# Altium project PCIC.PrjPCB
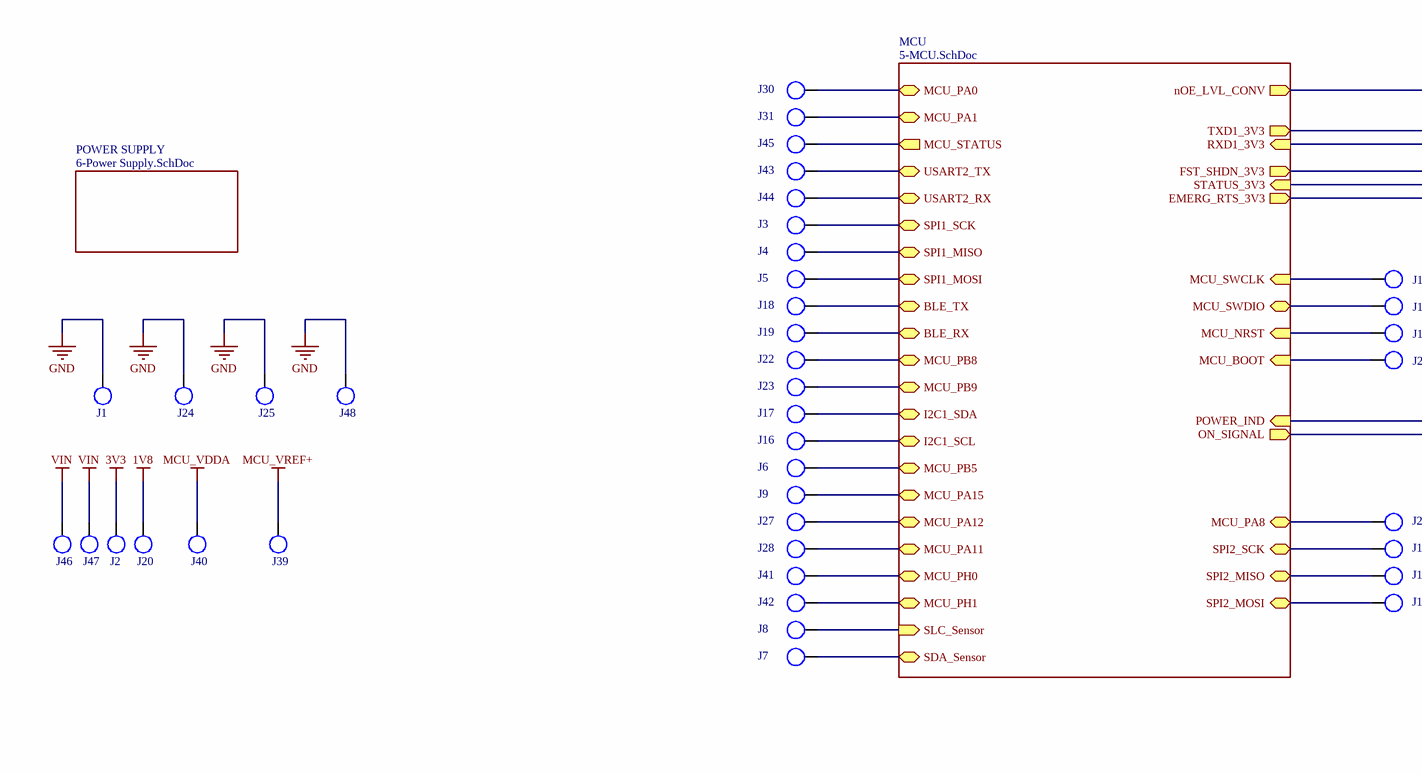
[diagram p0: 1-Main.SchDoc, left]
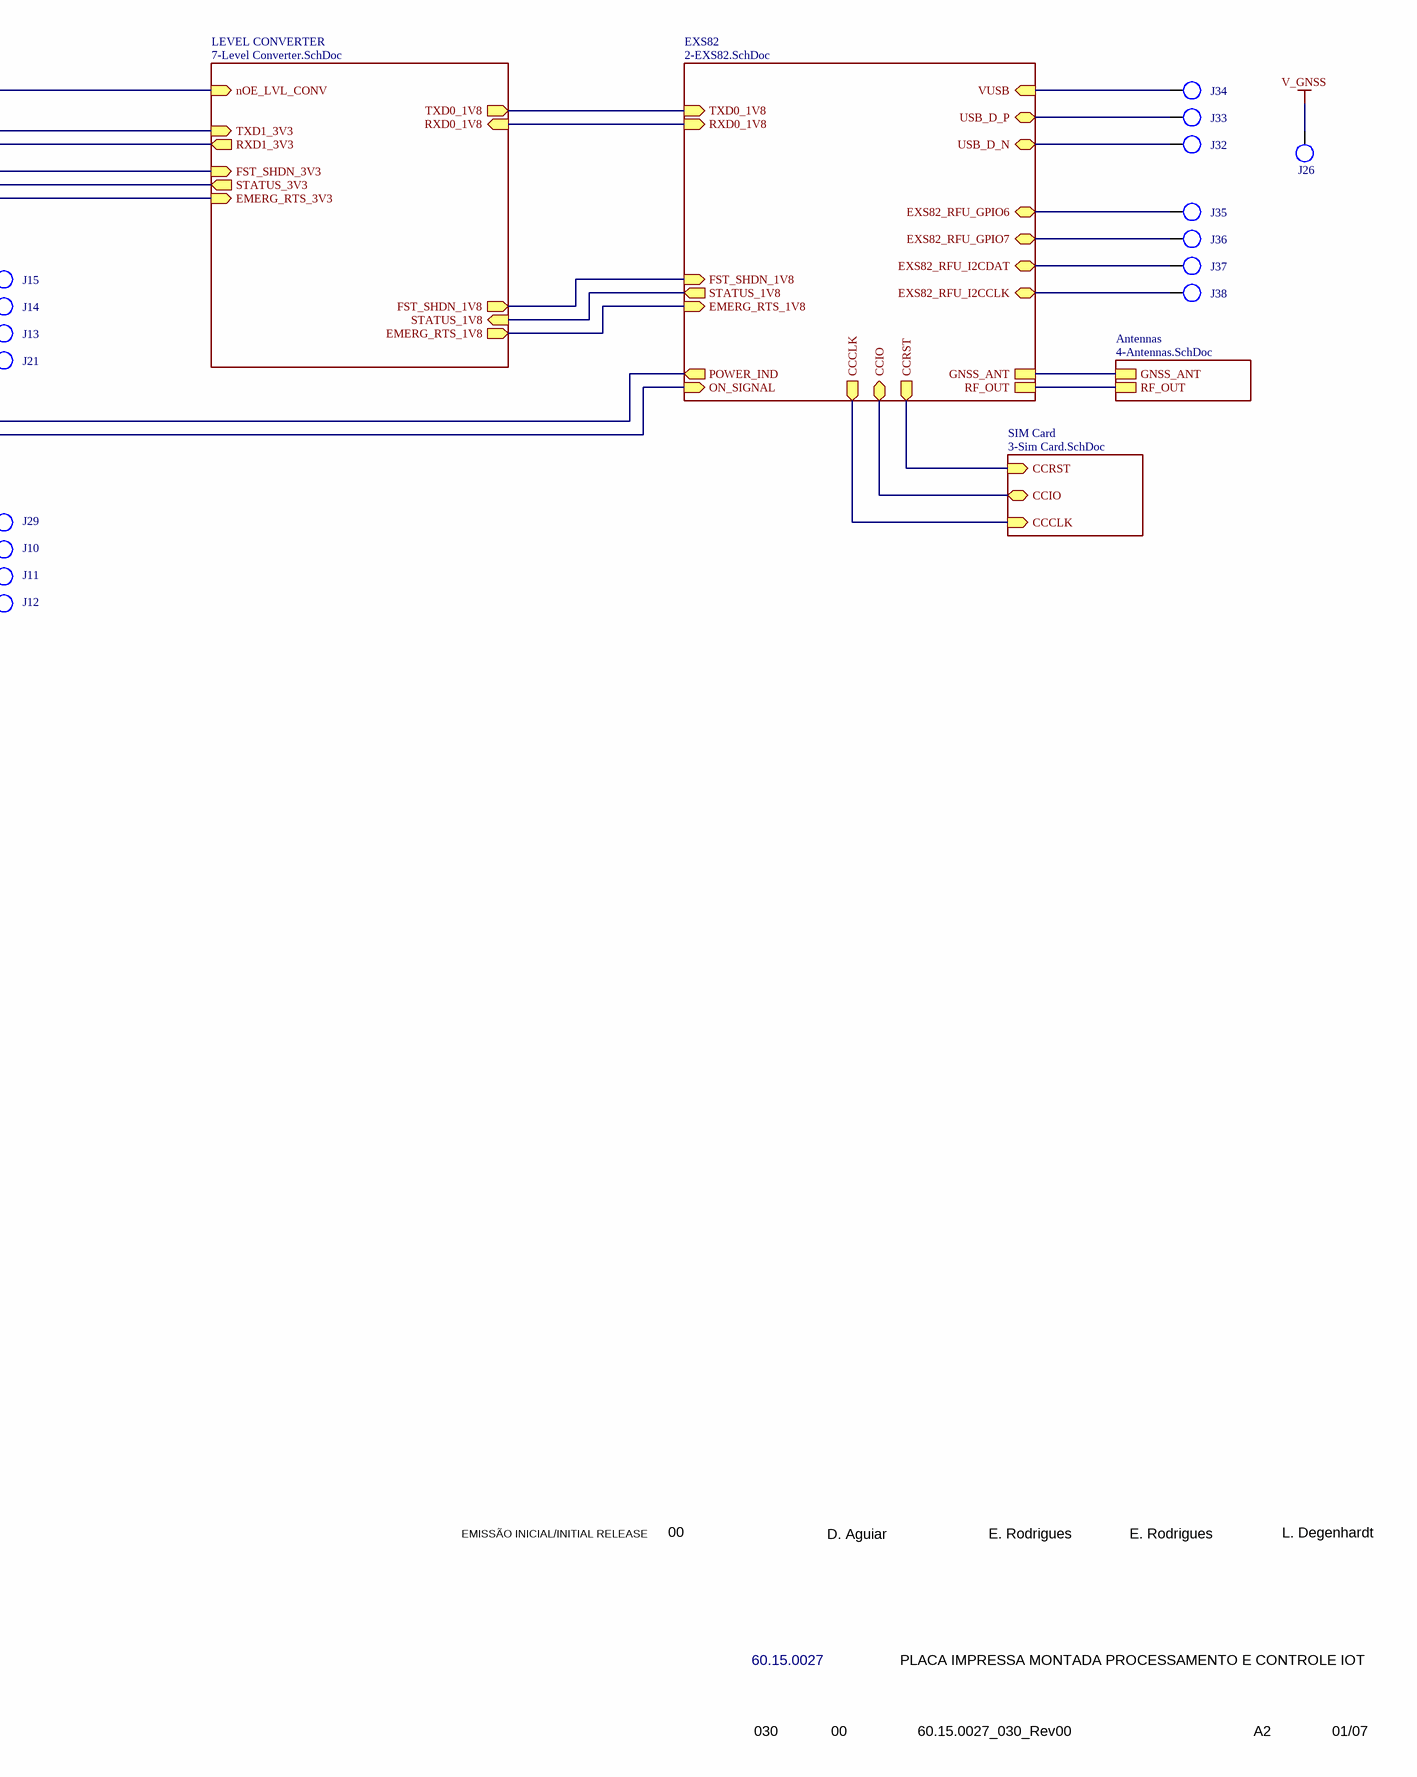
[diagram p1: 1-Main.SchDoc, right]
7 sheets, 168 parts. Net scope: hierarchical (ports join the sheet entries above them; power ports are global).
Board file: 58.13.0093_400_Rev00.PcbDoc
Sheets:
  1-Main.SchDoc
    MCU = 5-MCU.SchDoc
    LEVEL CONVERTER = 7-Level Converter.SchDoc
    EXS82 = 2-EXS82.SchDoc
    POWER SUPPLY = 6-Power Supply.SchDoc
    Antennas = 4-Antennas.SchDoc
    SIM Card = 3-Sim Card.SchDoc

## Sheet 1-Main.SchDoc
size 594 x 420 mm; SheetNumber: 1; SheetTotal: 7; Organization: Altium Limited; Address1: L3, 12a Rodborough Rd; Address2: Frenchs Forest; Address3: NSW; Address4: Australia 2086; PageSetup: Record=PageOptions|CenterHorizontal=True|CenterVertical=True|PrintScale=0.98|XCorrection=1.00|YCorrection=1.00|PrintKind=0|BorderSize=5000000|LeftOffset=0|BottomOffset=0|Orientation=2|PaperLength=1000|PaperWidth=1000|Scale=100|PaperSource=7|PrintQuality=-3|MediaType=1|DitherType=10|PrintScaleMode=1|PaperKind=A3|PaperIndex=8; NumTotalFolhas: 7; NumFolha: 1

### Parts
J1  CASTELATION  [CASTELATION]  (value not drawn)
J2  CASTELATION  [CASTELATION]  (value not drawn)
J3  CASTELATION  [CASTELATION]  (value not drawn)
J4  CASTELATION  [CASTELATION]  (value not drawn)
J5  CASTELATION  [CASTELATION]  (value not drawn)
J6  CASTELATION  [CASTELATION]  (value not drawn)
J7  CASTELATION  [CASTELATION]  (value not drawn)
J8  CASTELATION  [CASTELATION]  (value not drawn)
J9  CASTELATION  [CASTELATION]  (value not drawn)
J10  CASTELATION  [CASTELATION]  (value not drawn)
J11  CASTELATION  [CASTELATION]  (value not drawn)
J12  CASTELATION  [CASTELATION]  (value not drawn)
J13  CASTELATION  [CASTELATION]  (value not drawn)
J14  CASTELATION  [CASTELATION]  (value not drawn)
J15  CASTELATION  [CASTELATION]  (value not drawn)
J16  CASTELATION  [CASTELATION]  (value not drawn)
J17  CASTELATION  [CASTELATION]  (value not drawn)
J18  CASTELATION  [CASTELATION]  (value not drawn)
J19  CASTELATION  [CASTELATION]  (value not drawn)
J20  CASTELATION  [CASTELATION]  (value not drawn)
J21  CASTELATION  [CASTELATION]  (value not drawn)
J22  CASTELATION  [CASTELATION]  (value not drawn)
J23  CASTELATION  [CASTELATION]  (value not drawn)
J24  CASTELATION  [CASTELATION]  (value not drawn)
J25  CASTELATION  [CASTELATION]  (value not drawn)
J26  CASTELATION  [CASTELATION]  (value not drawn)
J27  CASTELATION  [CASTELATION]  (value not drawn)
J28  CASTELATION  [CASTELATION]  (value not drawn)
J29  CASTELATION  [CASTELATION]  (value not drawn)
J30  CASTELATION  [CASTELATION]  (value not drawn)
J31  CASTELATION  [CASTELATION]  (value not drawn)
J32  CASTELATION  [CASTELATION]  (value not drawn)
J33  CASTELATION  [CASTELATION]  (value not drawn)
J34  CASTELATION  [CASTELATION]  (value not drawn)
J35  CASTELATION  [CASTELATION]  (value not drawn)
J36  CASTELATION  [CASTELATION]  (value not drawn)
J37  CASTELATION  [CASTELATION]  (value not drawn)
J38  CASTELATION  [CASTELATION]  (value not drawn)
J39  CASTELATION  [CASTELATION]  (value not drawn)
J40  CASTELATION  [CASTELATION]  (value not drawn)
J41  CASTELATION  [CASTELATION]  (value not drawn)
J42  CASTELATION  [CASTELATION]  (value not drawn)
J43  CASTELATION  [CASTELATION]  (value not drawn)
J44  CASTELATION  [CASTELATION]  (value not drawn)
J45  CASTELATION  [CASTELATION]  (value not drawn)
J46  CASTELATION  [CASTELATION]  (value not drawn)
J47  CASTELATION  [CASTELATION]  (value not drawn)
J48  CASTELATION  [CASTELATION]  (value not drawn)

### Sub-sheets
Antennas = 4-Antennas.SchDoc: RF_OUT, GNSS_ANT
EXS82 = 2-EXS82.SchDoc: EMERG_RTS_1V8 (in), RXD0_1V8 (in), VUSB (in), USB_D_P (bidir), TXD0_1V8 (in), USB_D_N (bidir), POWER_IND (out), ON_SIGNAL (in), EXS82_RFU_GPIO6 (bidir), EXS82_RFU_GPIO7 (bidir), EXS82_RFU_I2CDAT (bidir), EXS82_RFU_I2CCLK (bidir), FST_SHDN_1V8 (in), STATUS_1V8 (out), GNSS_ANT, RF_OUT, CCRST (out), CCIO (bidir), CCCLK (out)
LEVEL CONVERTER = 7-Level Converter.SchDoc: RXD1_3V3 (out), RXD0_1V8 (in), TXD0_1V8 (out), EMERG_RTS_1V8 (out), TXD1_3V3 (in), EMERG_RTS_3V3 (in), STATUS_1V8 (in), STATUS_3V3 (out), FST_SHDN_3V3 (in), FST_SHDN_1V8 (out), nOE_LVL_CONV (in)
MCU = 5-MCU.SchDoc: RXD1_3V3 (in), TXD1_3V3 (out), EMERG_RTS_3V3 (out), MCU_PH1 (bidir), MCU_PA11 (bidir), MCU_PA12 (bidir), POWER_IND (in), MCU_PB5 (bidir), MCU_PH0 (bidir), ON_SIGNAL (out), I2C1_SDA (bidir), BLE_TX (bidir), MCU_PA15 (bidir), SPI1_MOSI (bidir), MCU_PB8 (bidir), MCU_SWCLK (in), I2C1_SCL (bidir), MCU_SWDIO (bidir), SPI1_MISO (bidir), SPI1_SCK (bidir), MCU_PB9 (bidir), USART2_RX (bidir), BLE_RX (bidir), USART2_TX (bidir), MCU_STATUS (out), MCU_PA0 (bidir), MCU_PA1 (bidir), MCU_NRST (in), STATUS_3V3 (in), FST_SHDN_3V3 (out), nOE_LVL_CONV (out), MCU_BOOT (in), MCU_PA8 (bidir), SPI2_MOSI (bidir), SPI2_MISO (bidir), SPI2_SCK (bidir), SLC_Sensor (in), SDA_Sensor (bidir)
POWER SUPPLY = 6-Power Supply.SchDoc: no entries
SIM Card = 3-Sim Card.SchDoc: CCRST (in), CCCLK (in), CCIO (bidir)

### Nets
1V8: J20.1
3V3: J2.1
GND: J1.1 J24.1 J25.1 J48.1
MCU_VDDA: J40.1
MCU_VREF+: J39.1
V_GNSS: J26.1
VIN: J46.1 J47.1
BLE_RX: J19.1 ; sheet MCU/BLE_RX
BLE_TX: J18.1 ; sheet MCU/BLE_TX
CCCLK: sheet EXS82/CCCLK, sheet SIM Card/CCCLK
CCIO: sheet EXS82/CCIO, sheet SIM Card/CCIO
CCRST: sheet EXS82/CCRST, sheet SIM Card/CCRST
EMERG_RTS_1V8: sheet LEVEL CONVERTER/EMERG_RTS_1V8, sheet EXS82/EMERG_RTS_1V8
EMERG_RTS_3V3: sheet MCU/EMERG_RTS_3V3, sheet LEVEL CONVERTER/EMERG_RTS_3V3
EXS82_RFU_GPIO6: J35.1 ; sheet EXS82/EXS82_RFU_GPIO6
EXS82_RFU_GPIO7: J36.1 ; sheet EXS82/EXS82_RFU_GPIO7
EXS82_RFU_I2CCLK: J38.1 ; sheet EXS82/EXS82_RFU_I2CCLK
EXS82_RFU_I2CDAT: J37.1 ; sheet EXS82/EXS82_RFU_I2CDAT
FST_SHDN_1V8: sheet LEVEL CONVERTER/FST_SHDN_1V8, sheet EXS82/FST_SHDN_1V8
FST_SHDN_3V3: sheet MCU/FST_SHDN_3V3, sheet LEVEL CONVERTER/FST_SHDN_3V3
GNSS_ANT: sheet EXS82/GNSS_ANT, sheet Antennas/GNSS_ANT
I2C1_SCL: J16.1 ; sheet MCU/I2C1_SCL
I2C1_SDA: J17.1 ; sheet MCU/I2C1_SDA
MCU_BOOT: J21.1 ; sheet MCU/MCU_BOOT
MCU_NRST: J13.1 ; sheet MCU/MCU_NRST
MCU_PA0: J30.1 ; sheet MCU/MCU_PA0
MCU_PA1: J31.1 ; sheet MCU/MCU_PA1
MCU_PA8: J29.1 ; sheet MCU/MCU_PA8
MCU_PA11: J28.1 ; sheet MCU/MCU_PA11
MCU_PA12: J27.1 ; sheet MCU/MCU_PA12
MCU_PA15: J9.1 ; sheet MCU/MCU_PA15
MCU_PB5: J6.1 ; sheet MCU/MCU_PB5
MCU_PB8: J22.1 ; sheet MCU/MCU_PB8
MCU_PB9: J23.1 ; sheet MCU/MCU_PB9
MCU_PH0: J41.1 ; sheet MCU/MCU_PH0
MCU_PH1: J42.1 ; sheet MCU/MCU_PH1
MCU_STATUS: J45.1 ; sheet MCU/MCU_STATUS
MCU_SWCLK: J15.1 ; sheet MCU/MCU_SWCLK
MCU_SWDIO: J14.1 ; sheet MCU/MCU_SWDIO
nOE_LVL_CONV: sheet MCU/nOE_LVL_CONV, sheet LEVEL CONVERTER/nOE_LVL_CONV
ON_SIGNAL: sheet MCU/ON_SIGNAL, sheet EXS82/ON_SIGNAL
POWER_IND: sheet MCU/POWER_IND, sheet EXS82/POWER_IND
RF_OUT: sheet EXS82/RF_OUT, sheet Antennas/RF_OUT
RXD0_1V8: sheet LEVEL CONVERTER/RXD0_1V8, sheet EXS82/RXD0_1V8
RXD1_3V3: sheet MCU/RXD1_3V3, sheet LEVEL CONVERTER/RXD1_3V3
SDA_Sensor: J7.1 ; sheet MCU/SDA_Sensor
SLC_Sensor: J8.1 ; sheet MCU/SLC_Sensor
SPI1_MISO: J4.1 ; sheet MCU/SPI1_MISO
SPI1_MOSI: J5.1 ; sheet MCU/SPI1_MOSI
SPI1_SCK: J3.1 ; sheet MCU/SPI1_SCK
SPI2_MISO: J11.1 ; sheet MCU/SPI2_MISO
SPI2_MOSI: J12.1 ; sheet MCU/SPI2_MOSI
SPI2_SCK: J10.1 ; sheet MCU/SPI2_SCK
STATUS_1V8: sheet LEVEL CONVERTER/STATUS_1V8, sheet EXS82/STATUS_1V8
STATUS_3V3: sheet MCU/STATUS_3V3, sheet LEVEL CONVERTER/STATUS_3V3
TXD0_1V8: sheet LEVEL CONVERTER/TXD0_1V8, sheet EXS82/TXD0_1V8
TXD1_3V3: sheet MCU/TXD1_3V3, sheet LEVEL CONVERTER/TXD1_3V3
USART2_RX: J44.1 ; sheet MCU/USART2_RX
USART2_TX: J43.1 ; sheet MCU/USART2_TX
USB_D_N: J32.1 ; sheet EXS82/USB_D_N
USB_D_P: J33.1 ; sheet EXS82/USB_D_P
VUSB: J34.1 ; sheet EXS82/VUSB

### Notes on the sheet
- EMISSÃO INICIAL/INITIAL RELEASE
- 00
- D. Aguiar
- E. Rodrigues
- L. Degenhardt
- 60.15.0027
- PLACA IMPRESSA MONTADA PROCESSAMENTO E CONTROLE IOT
- 030
- 60.15.0027_030_Rev00
- A2
- 01/07
- 1
- 2
- 3
- 4
- 5
- 6
- 7
- 8
- A
- B
- C
- D
- E
- F
- G
- H
- HISTORICO DA REV / EVOLUTION
- REV
- DATA / DATE
- DOCUMENTO DE ENGENHARIA DE PRODUTO
- ELABORADO / DRAWN
- DOCUMENT OF PRODUCT ENGINEERING
- VERIFICADO / CHECKED
- APROVADO / APPROVED
- QUALIDADE / QUALITY
- CÓDIGO / CODE
- DESCRIÇÃO / DESCRIPTION
- DOC
- ARQUIVO / FILE
- FORM./SIZE
- FOLHA / PAGE

## Sheet 5-MCU.SchDoc
size 594 x 420 mm; SheetNumber: 5; SheetTotal: 7; PageSetup: Record=PageOptions|CenterHorizontal=False|CenterVertical=False|PrintScale=0.43|XCorrection=0.00|YCorrection=0.00|PrintKind=1|BorderSize=5000000|LeftOffset=0|BottomOffset=0|Orientation=2|PaperLength=5940|PaperWidth=4200|Scale=100|PaperSource=7|PrintQuality=-4|MediaType=1|DitherType=10|PaperKind=Personal. 1: 215,9 x 279,4 mm|PrintScaleMode=0; NumTotalFolhas: 7; NumFolha: 5
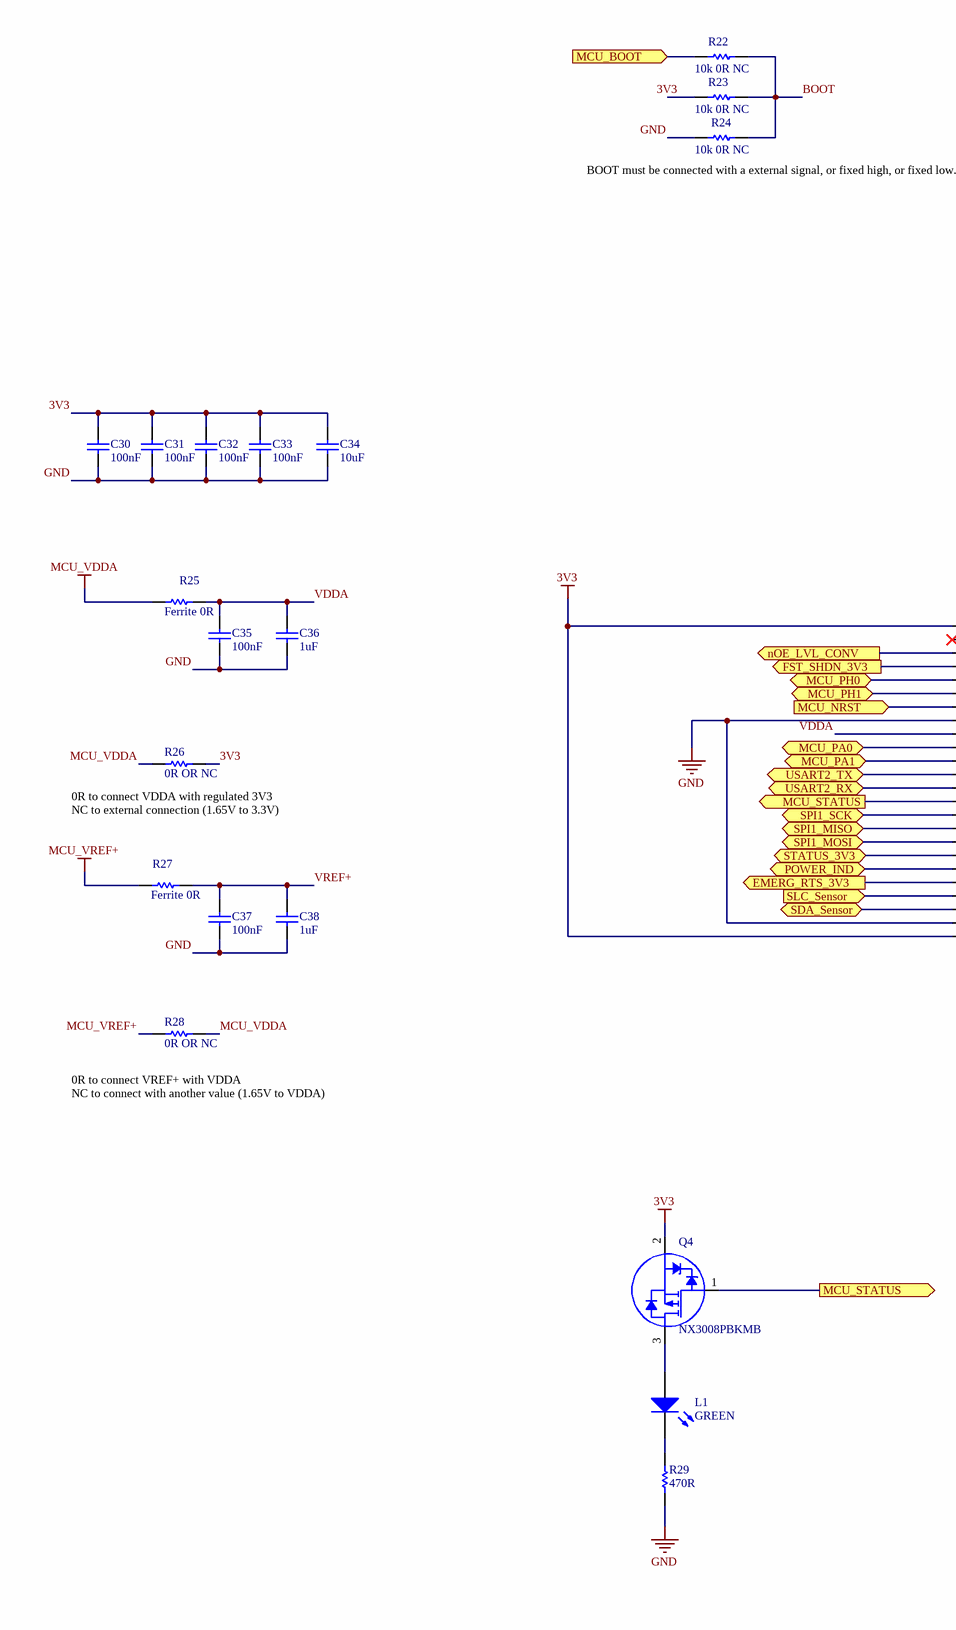
[diagram p2: 5-MCU.SchDoc, left]
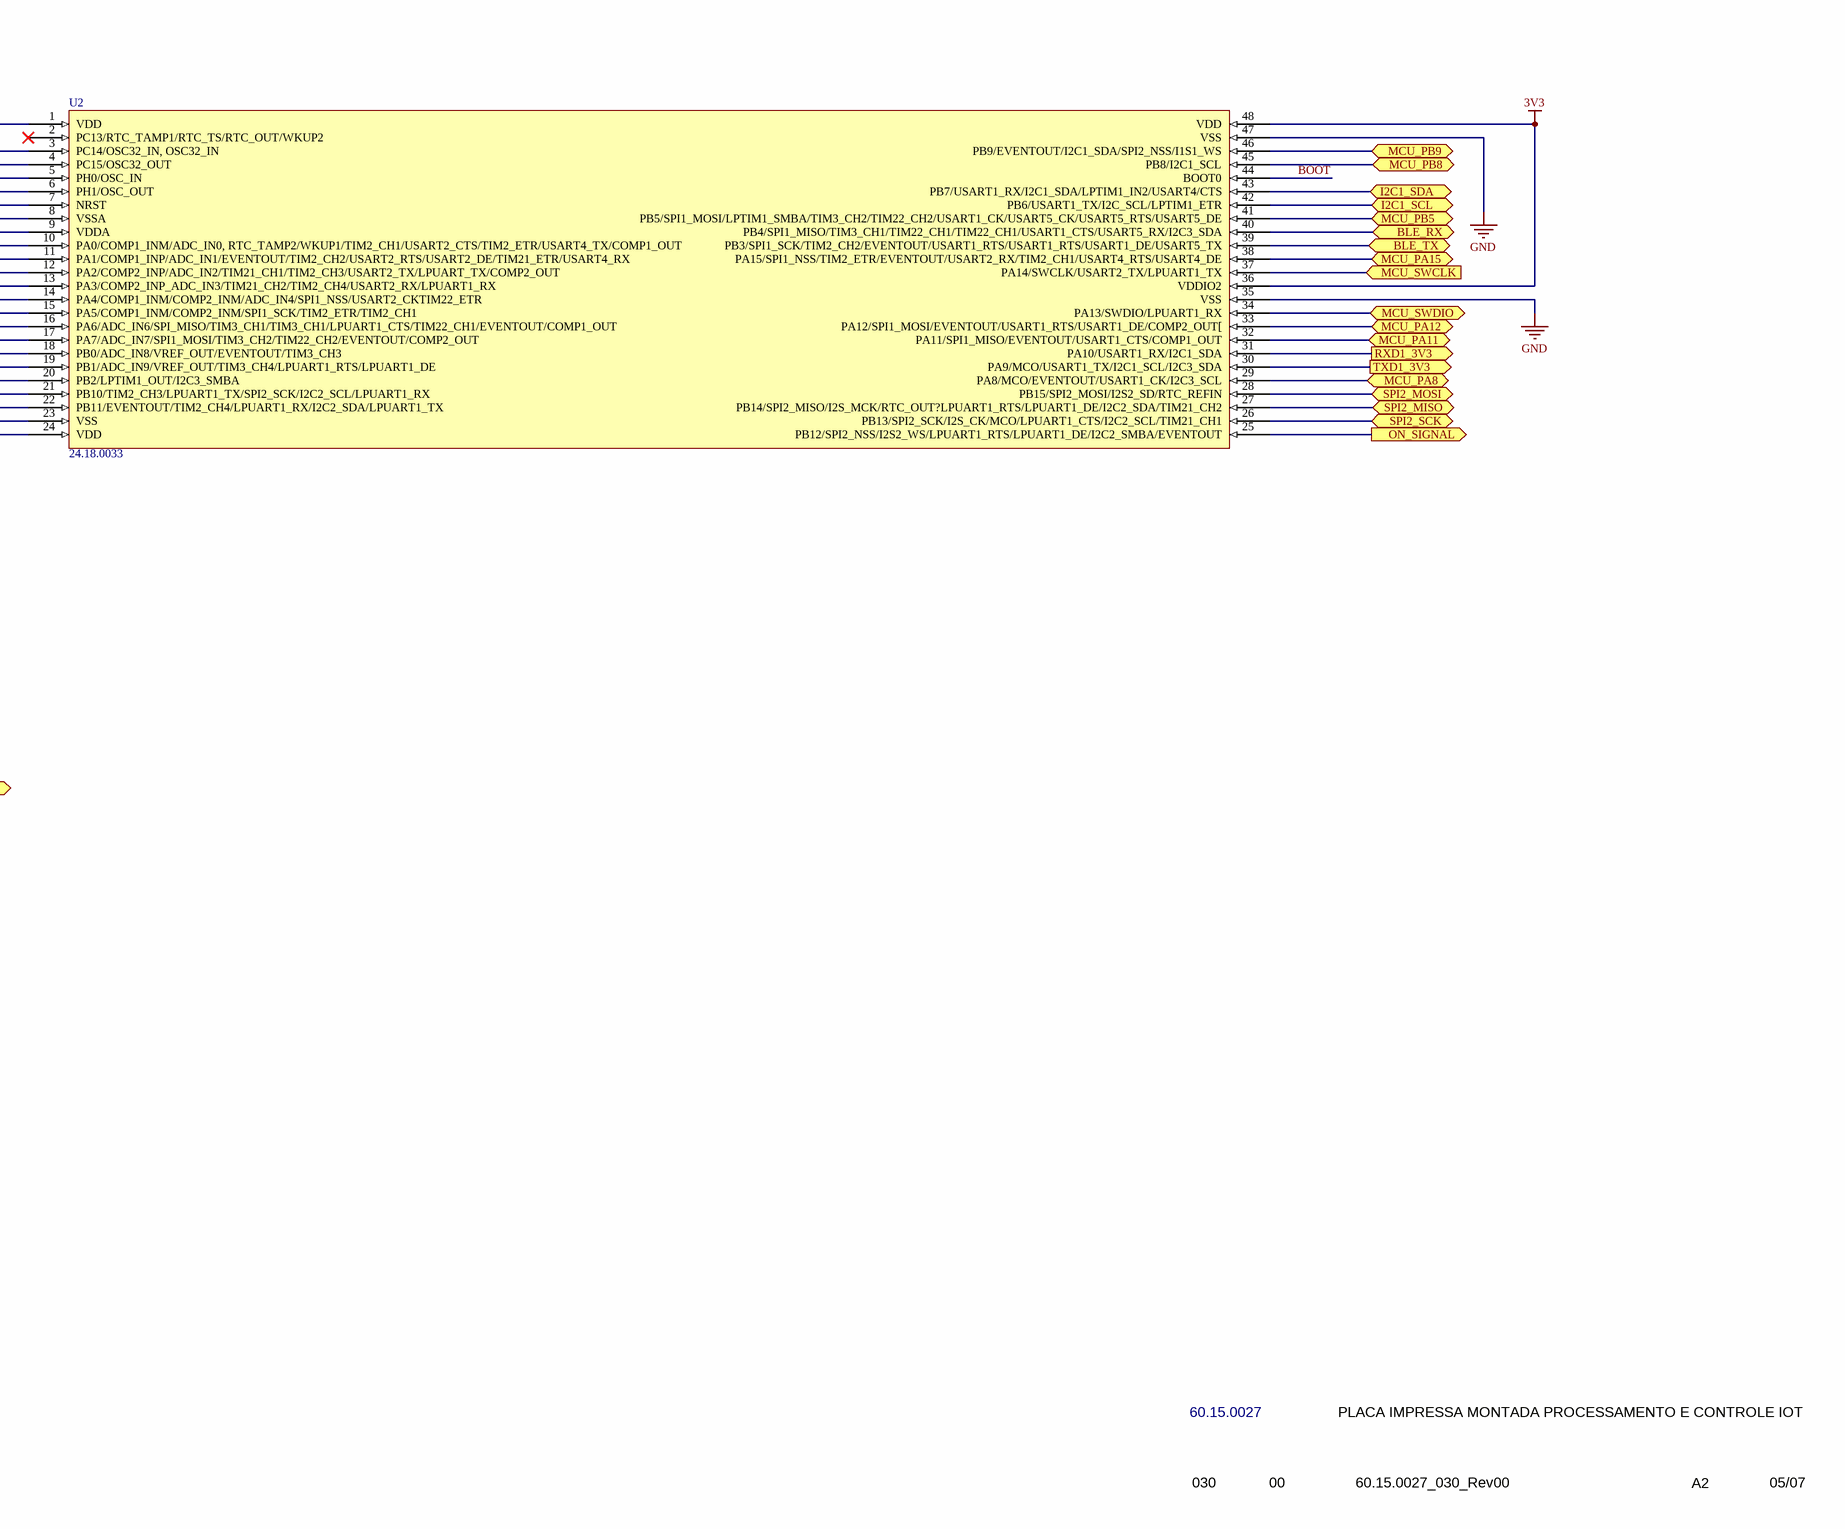
[diagram p3: 5-MCU.SchDoc, right]

### Parts
C30  16.23.0803  [16.23.0803]  (value not drawn)
C31  16.23.0803  [16.23.0803]  (value not drawn)
C32  16.23.0803  [16.23.0803]  (value not drawn)
C33  16.23.0803  [16.23.0803]  (value not drawn)
C34  value 10uF  [16.23.0805]  (hidden comment: 16.23.0805)
C35  16.23.0803  [16.23.0803]  (value not drawn)
C36  value 1uF  [16.23.0806]  (hidden comment: 16.23.0806)
C37  16.23.0803  [16.23.0803]  (value not drawn)
C38  value 1uF  [16.23.0806]  (hidden comment: 16.23.0806)
L1  32.17.0036  [32.17.0036]  (value not drawn)
Q4  72.19.0071  [72.19.0071]  (value not drawn)
R22  value 10k 0R NC  [66.21.1646]  (hidden comment: 66.21.1646)
R23  value 10k 0R NC  [66.21.1646]  (hidden comment: 66.21.1646)
R24  value 10k 0R NC  [66.21.1646]  (hidden comment: 66.21.1646)
R25  value Ferrite 0R  [66.24.1337]  (hidden comment: 66.24.1337)
R26  value 0R OR NC  [66.24.1337]  (hidden comment: 66.24.1337)
R27  value Ferrite 0R  [66.24.1337]  (hidden comment: 66.24.1337)
R28  value 0R OR NC  [66.24.1337]  (hidden comment: 66.24.1337)
R29  value 470R  [66.33.4700]  (hidden comment: 66.33.4700)
U2  24.18.0033  [24.18.0033]

### Ports
BLE_RX (bidir), BLE_TX (bidir), EMERG_RTS_3V3 (out), FST_SHDN_3V3 (out), I2C1_SCL (bidir), I2C1_SDA (bidir), MCU_BOOT (in), MCU_NRST (in), MCU_PA0 (bidir), MCU_PA1 (bidir), MCU_PA8 (bidir), MCU_PA11 (bidir), MCU_PA12 (bidir), MCU_PA15 (bidir), MCU_PB5 (bidir), MCU_PB8 (bidir), MCU_PB9 (bidir), MCU_PH0 (bidir), MCU_PH1 (bidir), MCU_STATUS (out), MCU_SWCLK (in), MCU_SWDIO (bidir), nOE_LVL_CONV (out), ON_SIGNAL (out), POWER_IND (bidir), RXD1_3V3 (out), SDA_Sensor (bidir), SLC_Sensor (in), SPI1_MISO (bidir), SPI1_MOSI (bidir), SPI1_SCK (bidir), SPI2_MISO (bidir), SPI2_MOSI (bidir), SPI2_SCK (bidir), STATUS_3V3 (bidir), TXD1_3V3 (out), USART2_RX (bidir), USART2_TX (bidir)

### Nets
3V3: C30.2 C31.2 C32.2 C33.2 C34.2 Q4.2(S) R23.1 R26.2 U2.1(VDD) U2.24(VDD) U2.36(VDDIO2) U2.48(VDD)
GND: C30.1 C31.1 C32.1 C33.1 C34.1 C35.1 C36.1 C37.1 C38.1 R24.1 R29.1 U2.8(VSSA) U2.23(VSS) U2.35(VSS) U2.47(VSS)
MCU_VDDA: R25.1 R26.1 R28.2
MCU_VREF+: R27.1 R28.1
BLE_RX: U2.40(PB4/SPI1_MISO/TIM3_CH1/TIM22_CH1/TIM22_CH1/USART1_CTS/USART5_RX/I2C3_SDA) ; port BLE_RX
BLE_TX: U2.39(PB3/SPI1_SCK/TIM2_CH2/EVENTOUT/USART1_RTS/USART1_RTS/USART1_DE/USART5_TX) ; port BLE_TX
BOOT: R22.2 R23.2 R24.2 U2.44(BOOT0)
EMERG_RTS_3V3: U2.20(PB2/LPTIM1_OUT/I2C3_SMBA) ; port EMERG_RTS_3V3
FST_SHDN_3V3: U2.4(PC15/OSC32_OUT) ; port FST_SHDN_3V3
I2C1_SCL: U2.42(PB6/USART1_TX/I2C_SCL/LPTIM1_ETR) ; port I2C1_SCL
I2C1_SDA: U2.43(PB7/USART1_RX/I2C1_SDA/LPTIM1_IN2/USART4/CTS) ; port I2C1_SDA
MCU_BOOT: R22.1 ; port MCU_BOOT
MCU_NRST: U2.7(NRST) ; port MCU_NRST
MCU_PA0: U2.10(PA0/COMP1_INM/ADC_IN0,_RTC_TAMP2/WKUP1/TIM2_CH1/USART2_CTS/TIM2_ETR/USART4_TX/COMP1_OUT) ; port MCU_PA0
MCU_PA1: U2.11(PA1/COMP1_INP/ADC_IN1/EVENTOUT/TIM2_CH2/USART2_RTS/USART2_DE/TIM21_ETR/USART4_RX) ; port MCU_PA1
MCU_PA8: U2.29(PA8/MCO/EVENTOUT/USART1_CK/I2C3_SCL) ; port MCU_PA8
MCU_PA11: U2.32(PA11/SPI1_MISO/EVENTOUT/USART1_CTS/COMP1_OUT) ; port MCU_PA11
MCU_PA12: U2.33(PA12/SPI1_MOSI/EVENTOUT/USART1_RTS/USART1_DE/COMP2_OUT[) ; port MCU_PA12
MCU_PA15: U2.38(PA15/SPI1_NSS/TIM2_ETR/EVENTOUT/USART2_RX/TIM2_CH1/USART4_RTS/USART4_DE) ; port MCU_PA15
MCU_PB5: U2.41(PB5/SPI1_MOSI/LPTIM1_SMBA/TIM3_CH2/TIM22_CH2/USART1_CK/USART5_CK/USART5_RTS/USART5_DE) ; port MCU_PB5
MCU_PB8: U2.45(PB8/I2C1_SCL) ; port MCU_PB8
MCU_PB9: U2.46(PB9/EVENTOUT/I2C1_SDA/SPI2_NSS/I1S1_WS) ; port MCU_PB9
MCU_PH0: U2.5(PH0/OSC_IN) ; port MCU_PH0
MCU_PH1: U2.6(PH1/OSC_OUT) ; port MCU_PH1
MCU_STATUS: Q4.1(G) U2.14(PA4/COMP1_INM/COMP2_INM/ADC_IN4/SPI1_NSS/USART2_CKTIM22_ETR) ; port MCU_STATUS
MCU_SWCLK: U2.37(PA14/SWCLK/USART2_TX/LPUART1_TX) ; port MCU_SWCLK
MCU_SWDIO: U2.34(PA13/SWDIO/LPUART1_RX) ; port MCU_SWDIO
nOE_LVL_CONV: U2.3(PC14/OSC32_IN,_OSC32_IN) ; port nOE_LVL_CONV
ON_SIGNAL: U2.25(PB12/SPI2_NSS/I2S2_WS/LPUART1_RTS/LPUART1_DE/I2C2_SMBA/EVENTOUT) ; port ON_SIGNAL
POWER_IND: U2.19(PB1/ADC_IN9/VREF_OUT/TIM3_CH4/LPUART1_RTS/LPUART1_DE) ; port POWER_IND
RXD1_3V3: U2.31(PA10/USART1_RX/I2C1_SDA) ; port RXD1_3V3
SDA_Sensor: U2.22(PB11/EVENTOUT/TIM2_CH4/LPUART1_RX/I2C2_SDA/LPUART1_TX) ; port SDA_Sensor
SLC_Sensor: U2.21(PB10/TIM2_CH3/LPUART1_TX/SPI2_SCK/I2C2_SCL/LPUART1_RX) ; port SLC_Sensor
SPI1_MISO: U2.16(PA6/ADC_IN6/SPI_MISO/TIM3_CH1/TIM3_CH1/LPUART1_CTS/TIM22_CH1/EVENTOUT/COMP1_OUT) ; port SPI1_MISO
SPI1_MOSI: U2.17(PA7/ADC_IN7/SPI1_MOSI/TIM3_CH2/TIM22_CH2/EVENTOUT/COMP2_OUT) ; port SPI1_MOSI
SPI1_SCK: U2.15(PA5/COMP1_INM/COMP2_INM/SPI1_SCK/TIM2_ETR/TIM2_CH1) ; port SPI1_SCK
SPI2_MISO: U2.27(PB14/SPI2_MISO/I2S_MCK/RTC_OUT?LPUART1_RTS/LPUART1_DE/I2C2_SDA/TIM21_CH2) ; port SPI2_MISO
SPI2_MOSI: U2.28(PB15/SPI2_MOSI/I2S2_SD/RTC_REFIN) ; port SPI2_MOSI
SPI2_SCK: U2.26(PB13/SPI2_SCK/I2S_CK/MCO/LPUART1_CTS/I2C2_SCL/TIM21_CH1) ; port SPI2_SCK
STATUS_3V3: U2.18(PB0/ADC_IN8/VREF_OUT/EVENTOUT/TIM3_CH3) ; port STATUS_3V3
TXD1_3V3: U2.30(PA9/MCO/USART1_TX/I2C1_SCL/I2C3_SDA) ; port TXD1_3V3
USART2_RX: U2.13(PA3/COMP2_INP_ADC_IN3/TIM21_CH2/TIM2_CH4/USART2_RX/LPUART1_RX) ; port USART2_RX
USART2_TX: U2.12(PA2/COMP2_INP/ADC_IN2/TIM21_CH1/TIM2_CH3/USART2_TX/LPUART_TX/COMP2_OUT) ; port USART2_TX
VDDA: C35.2 C36.2 R25.2 U2.9(VDDA)
VREF+: C37.2 C38.2 R27.2
NetL1_A: L1.A Q4.3(D)
NetL1_K: L1.K R29.2

Not connected (* = marked no-connect by the designer): U2 2(PC13/RTC_TAMP1/RTC_TS/RTC_OUT/WKUP2)*

### Notes on the sheet
- (near R24) BOOT must be connected with a external signal, or fixed high, or fixed low. Selection by resistor.
- (near R26) 0R to connect VDDA with regulated 3V3
- (near R26) NC to external connection (1.65V to 3.3V)
- (near R28) 0R to connect VREF+ with VDDA
- NC to connect with another value (1.65V to VDDA)
- 60.15.0027
- PLACA IMPRESSA MONTADA PROCESSAMENTO E CONTROLE IOT
- 030
- 00
- 60.15.0027_030_Rev00
- A2
- 05/07
- 1
- 2
- 3
- 4
- 5
- 6
- 7
- 8
- A
- B
- C
- D
- E
- F
- G
- H
- DOCUMENTO DE ENGENHARIA DE PRODUTO
- DOCUMENT OF PRODUCT ENGINEERING
- CÓDIGO / CODE
- DESCRIÇÃO / DESCRIPTION
- DOC
- REV
- ARQUIVO / FILE
- FORM./SIZE
- FOLHA / PAGE
- (in symbol 16.23.0803) 100nF
- (in symbol 32.17.0036) GREEN
- (in symbol 72.19.0071) NX3008PBKMB

### Library data of the parts
C30-C33 C35 C37 = 16.23.0803: CAPACITOR CERAMICO 100nF 16V 10%% X5R SMD 0201
C34 = 16.23.0805: CAPACITOR CERAMICO MULTICAMADAS 10uF 10V X5R 10% SMD 0603
C36 C38 = 16.23.0806: CAPACITOR CERAMICO MULTICAMADAS 1uF 10V X5R 20% SMD 0201
L1 = 32.17.0036: LED VERDE 0603 SMD
Q4 = 72.19.0071: MOSFET CANAL P SMD 30V 230mA SOT883B
R22-R24 = 66.21.1646: RESISTOR THICK FILM 10k OHMS 25V 0.05W 1% SMD 0201
R25-R28 = 66.24.1337: RESISTOR THICK FILM 0,1W 0 OHMS SMD 0603
R29 = 66.33.4700: RES MET 0,125W 470 OHMS 5% SMD 0805
U2 = 24.18.0033: MICROCONTROLADOR 32BITS ARM 192KB FLASH 48 PINOS LQFP; Part Number: STM32L071CZTx; Manufactor: STMICROELETRONICS; ComponentLink1Description: Value; ComponentLink1URL: STM32L071CZTx

## Sheet 7-Level Converter.SchDoc
size 594 x 420 mm; SheetNumber: 7; SheetTotal: 7; PageSetup: Record=PageOptions|CenterHorizontal=False|CenterVertical=False|PrintScale=0.43|XCorrection=0.00|YCorrection=0.00|PrintKind=1|BorderSize=5000000|LeftOffset=0|BottomOffset=0|Orientation=2|PaperLength=5940|PaperWidth=4200|Scale=100|PaperSource=7|PrintQuality=-4|MediaType=1|DitherType=10|PaperKind=Personal. 1: 215,9 x 279,4 mm|PrintScaleMode=0; NumTotalFolhas: 7; NumFolha: 7
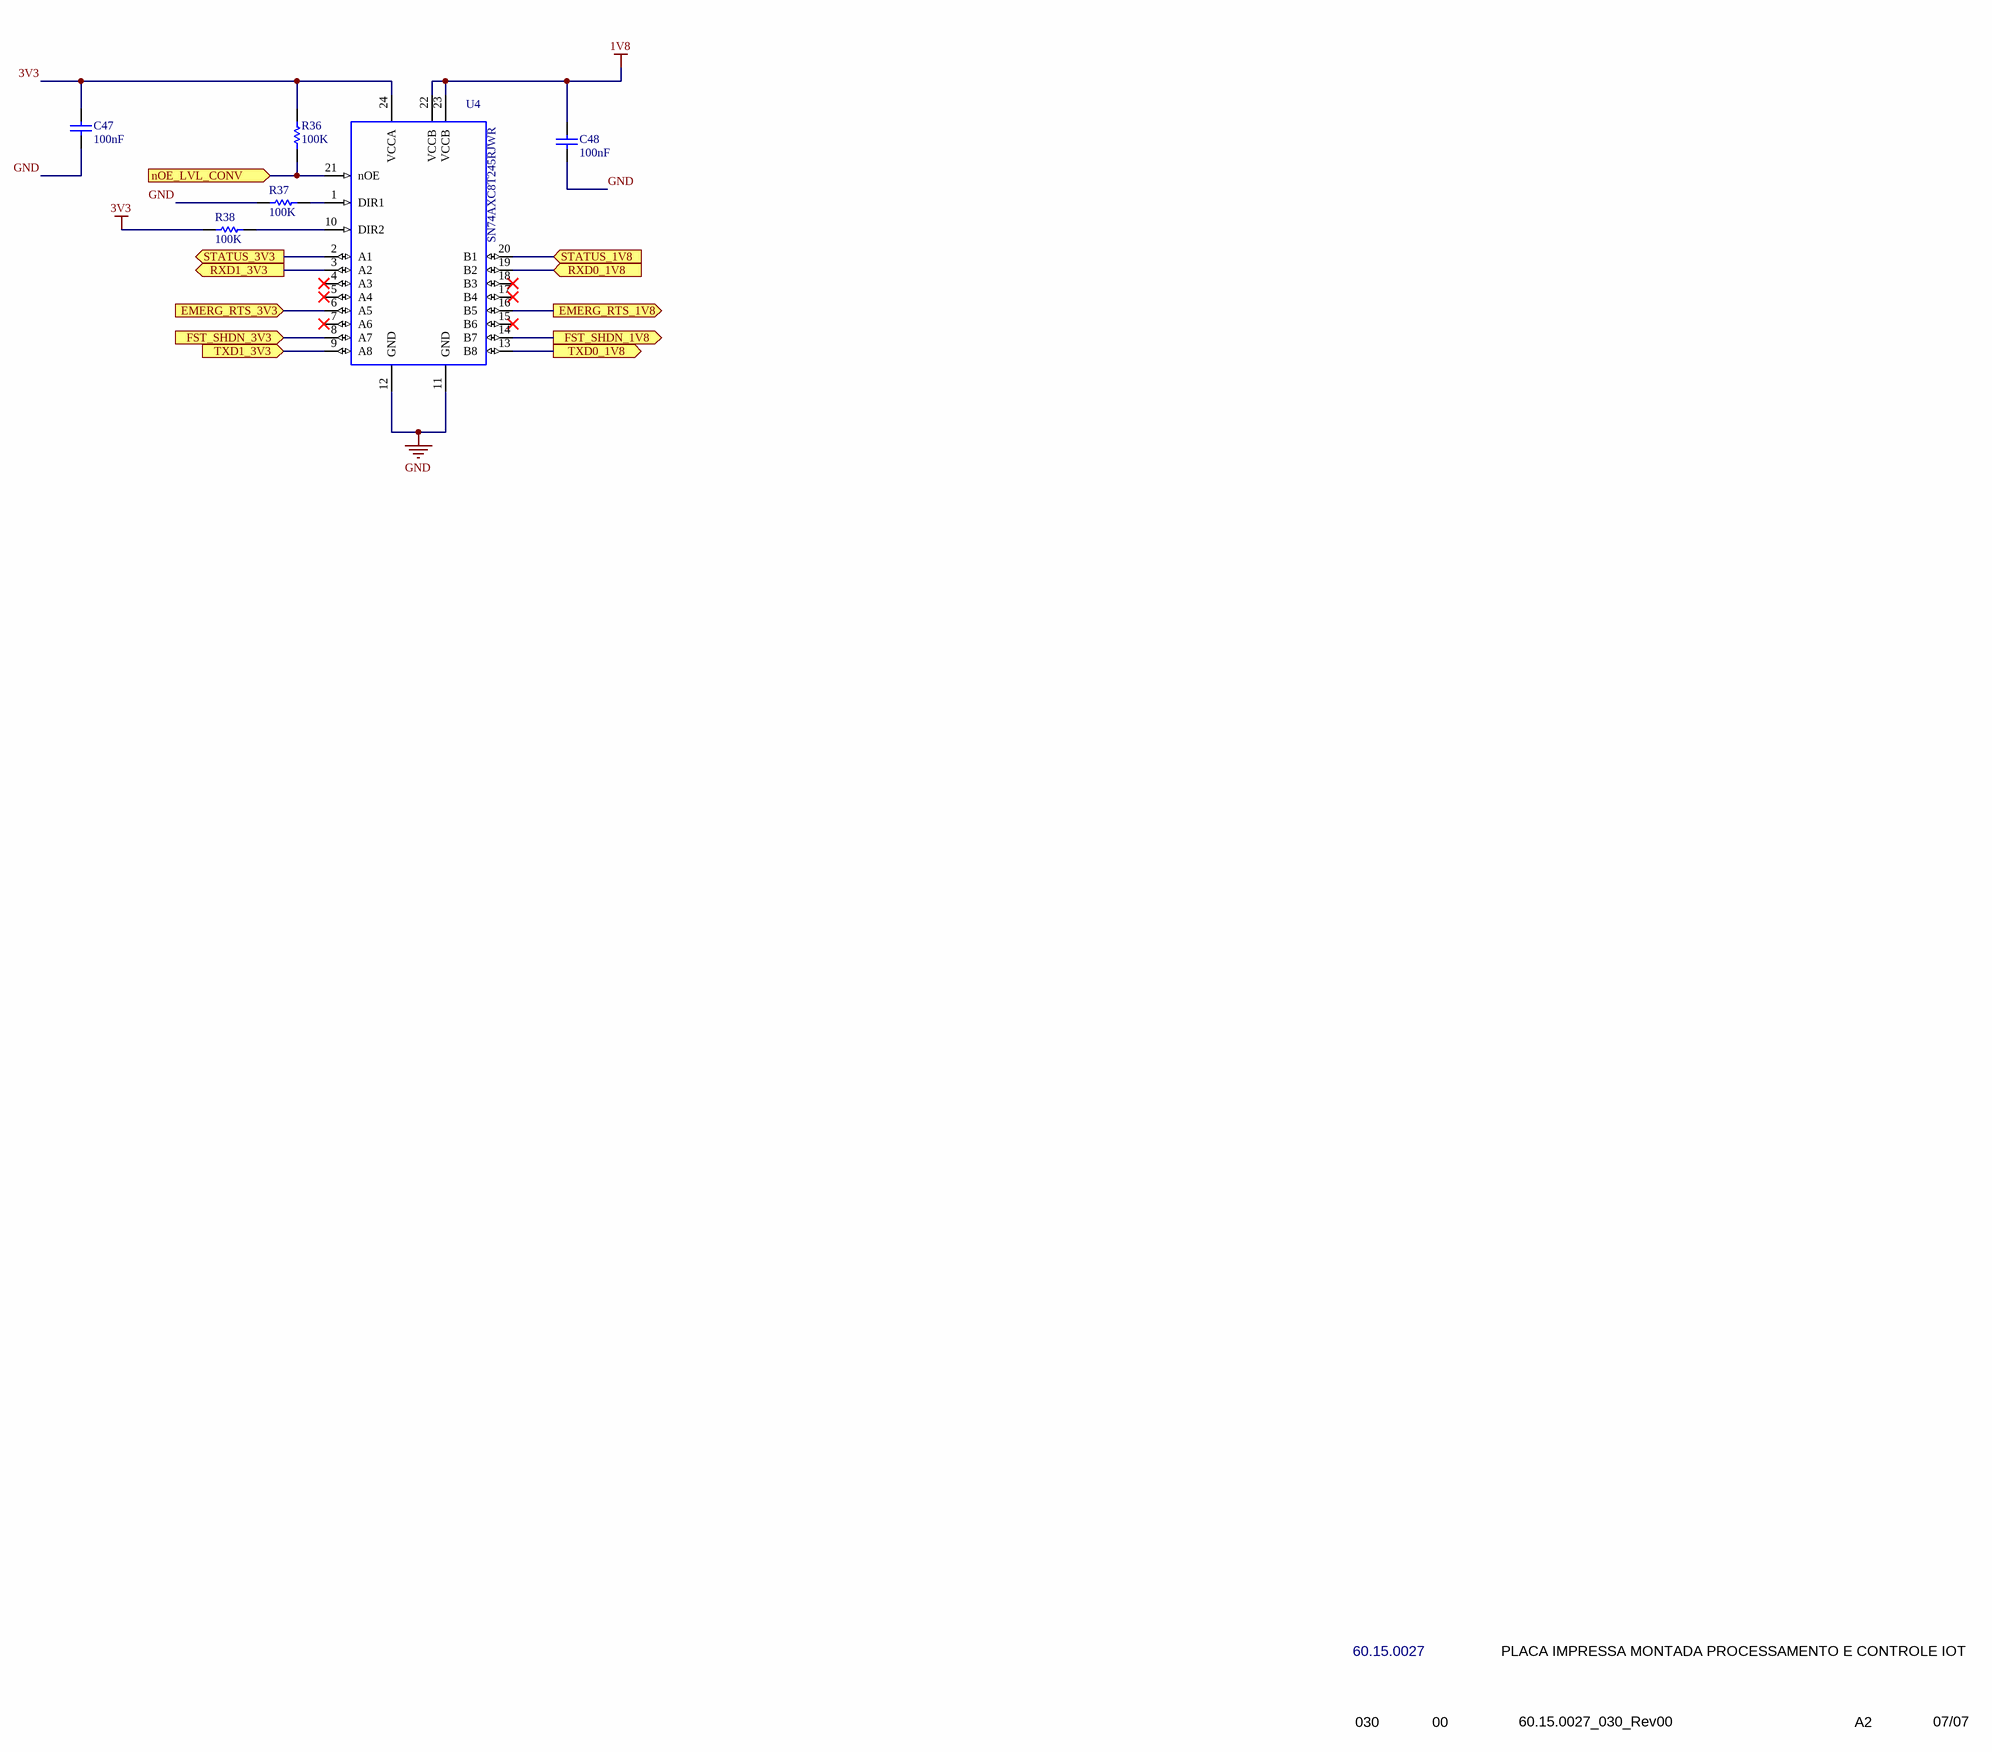
[diagram p4: 7-Level Converter.SchDoc]

### Parts
C47  16.23.0803  [16.23.0803]  (value not drawn)
C48  16.23.0803  [16.23.0803]  (value not drawn)
R36  value 100K  [66.24.1346]  (hidden comment: 66.24.1346)
R37  value 100K  [66.24.1346]  (hidden comment: 66.24.1346)
R38  value 100K  [66.24.1346]  (hidden comment: 66.24.1346)
U4  value SN74AXC8T245RJWR  [24.15.0640]  (hidden comment: 24.15.0640)

### Ports
EMERG_RTS_1V8 (out), EMERG_RTS_3V3 (in), FST_SHDN_1V8 (out), FST_SHDN_3V3 (in), nOE_LVL_CONV (in), RXD0_1V8 (in), RXD1_3V3 (out), STATUS_1V8 (in), STATUS_3V3 (out), TXD0_1V8 (out), TXD1_3V3 (in)

### Nets
1V8: C48.2 U4.22(VCCB) U4.23(VCCB)
3V3: C47.2 R36.1 R38.2 U4.24(VCCA)
GND: C47.1 C48.1 R37.2 U4.11(GND) U4.12(GND)
EMERG_RTS_1V8: U4.16(B5) ; port EMERG_RTS_1V8
EMERG_RTS_3V3: U4.6(A5) ; port EMERG_RTS_3V3
FST_SHDN_1V8: U4.14(B7) ; port FST_SHDN_1V8
FST_SHDN_3V3: U4.8(A7) ; port FST_SHDN_3V3
nOE_LVL_CONV: R36.2 U4.21(nOE) ; port nOE_LVL_CONV
RXD0_1V8: U4.19(B2) ; port RXD0_1V8
RXD1_3V3: U4.3(A2) ; port RXD1_3V3
STATUS_1V8: U4.20(B1) ; port STATUS_1V8
STATUS_3V3: U4.2(A1) ; port STATUS_3V3
TXD0_1V8: U4.13(B8) ; port TXD0_1V8
TXD1_3V3: U4.9(A8) ; port TXD1_3V3
NetR37_1: R37.1 U4.1(DIR1)
NetR38_1: R38.1 U4.10(DIR2)

Not connected (* = marked no-connect by the designer): U4 4(A3)* 5(A4)* 7(A6)* 15(B6)* 17(B4)* 18(B3)*

### Notes on the sheet
- 60.15.0027
- PLACA IMPRESSA MONTADA PROCESSAMENTO E CONTROLE IOT
- 030
- 00
- 60.15.0027_030_Rev00
- A2
- 07/07
- 1
- 2
- 3
- 4
- 5
- 6
- 7
- 8
- A
- B
- C
- D
- E
- F
- G
- H
- DOCUMENTO DE ENGENHARIA DE PRODUTO
- DOCUMENT OF PRODUCT ENGINEERING
- CÓDIGO / CODE
- DESCRIÇÃO / DESCRIPTION
- DOC
- REV
- ARQUIVO / FILE
- FORM./SIZE
- FOLHA / PAGE
- (in symbol 16.23.0803) 100nF

### Library data of the parts
C47 C48 = 16.23.0803: as C30 on sheet 5-MCU
R36-R38 = 66.24.1346: RESISTOR THICK FILM 50mW 100K OHMS 1% SMD 0201
U4 = 24.15.0640: CID CONVERSOR NIVEL ALIMENTACAO DUPLA DIRECAO CONTROLADA 8 BITS 0.65V - 3.6V

## Sheet 2-EXS82.SchDoc
size 594 x 420 mm; SheetNumber: 2; SheetTotal: 7; PageSetup: Record=PageOptions|CenterHorizontal=False|CenterVertical=False|PrintScale=0.43|XCorrection=0.00|YCorrection=0.00|PrintKind=1|BorderSize=5000000|LeftOffset=0|BottomOffset=0|Orientation=2|PaperLength=5940|PaperWidth=4200|Scale=100|PaperSource=7|PrintQuality=-4|MediaType=1|DitherType=10|PaperKind=Personal. 1: 215,9 x 279,4 mm|PrintScaleMode=0; NumTotalFolhas: 7; NumFolha: 2
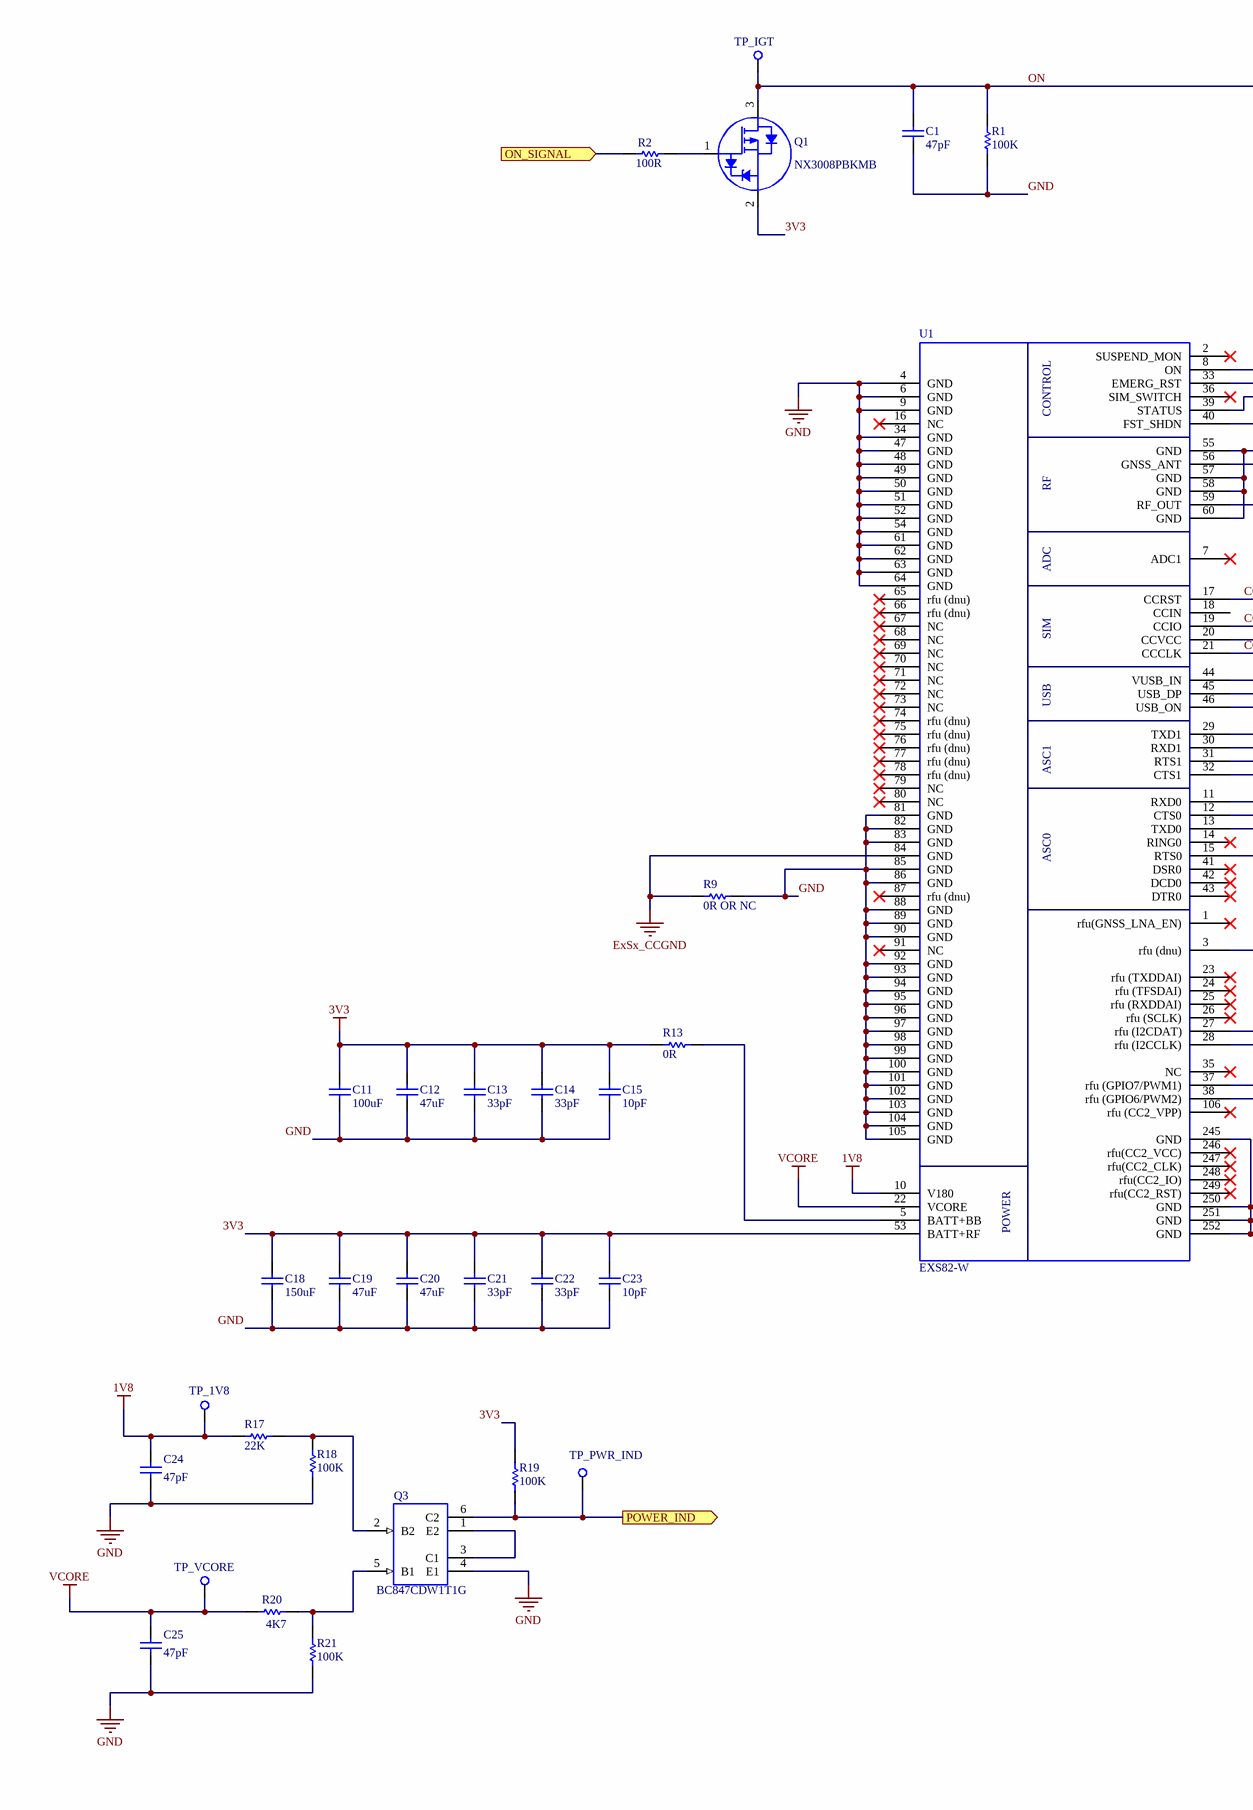
[diagram p5: 2-EXS82.SchDoc, left]
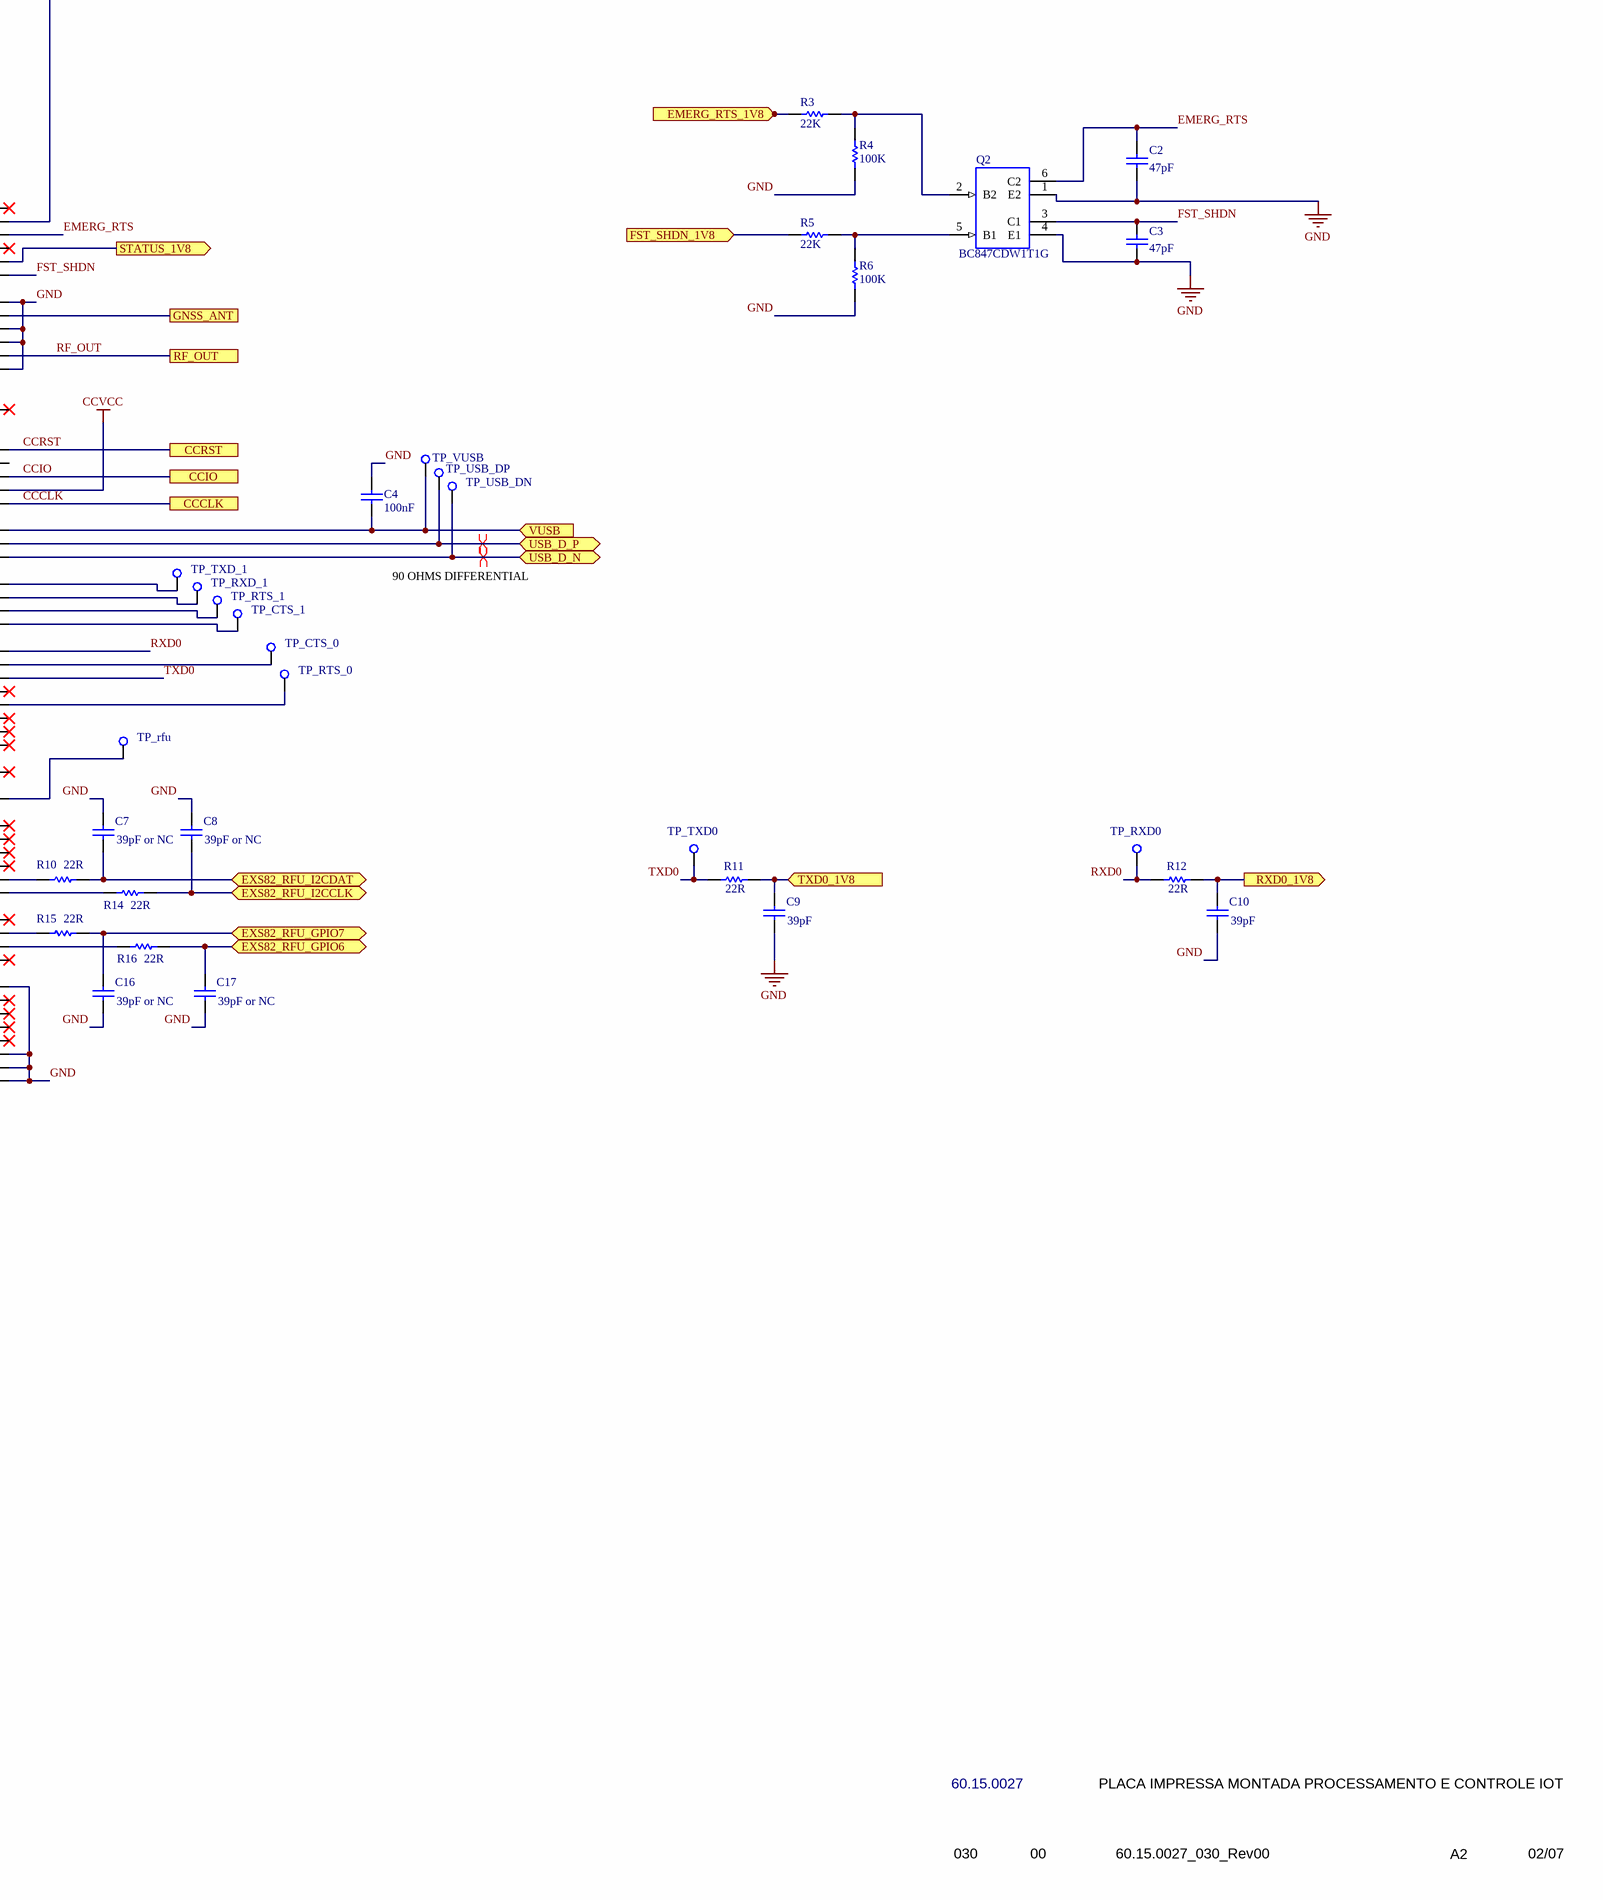
[diagram p6: 2-EXS82.SchDoc, right]

### Parts
C1  16.23.0798  [16.23.0798]  (value not drawn)
C2  16.23.0798  [16.23.0798]  (value not drawn)
C3  16.23.0798  [16.23.0798]  (value not drawn)
C4  16.23.0803  [16.23.0803]  (value not drawn)
C7  16.23.0802  [16.23.0802]  (value not drawn)
C8  16.23.0802  [16.23.0802]  (value not drawn)
C9  16.23.0802  [16.23.0802]  (value not drawn)
C10  16.23.0802  [16.23.0802]  (value not drawn)
C11  value 100uF  [16.23.0804]  (hidden comment: 16.23.0804)
C12  16.23.0795  [16.23.0795]  (value not drawn)
C13  16.23.0797  [16.23.0797]  (value not drawn)
C14  16.23.0797  [16.23.0797]  (value not drawn)
C15  16.23.0799  [16.23.0799]  (value not drawn)
C16  16.23.0802  [16.23.0802]  (value not drawn)
C17  16.23.0802  [16.23.0802]  (value not drawn)
C18  16.23.0789  [16.23.0789]  (value not drawn)
C19  16.23.0795  [16.23.0795]  (value not drawn)
C20  16.23.0795  [16.23.0795]  (value not drawn)
C21  16.23.0797  [16.23.0797]  (value not drawn)
C22  16.23.0797  [16.23.0797]  (value not drawn)
C23  16.23.0799  [16.23.0799]  (value not drawn)
C24  16.23.0798  [16.23.0798]  (value not drawn)
C25  16.23.0798  [16.23.0798]  (value not drawn)
Q1  72.19.0071  [72.19.0071]  (value not drawn)
Q2  72.26.0005  [72.26.0005]  (value not drawn)
Q3  72.26.0005  [72.26.0005]  (value not drawn)
R1  value 100K  [66.24.1346]  (hidden comment: 66.24.1346)
R2  value 100R  [66.24.1342]  (hidden comment: 66.24.1342)
R3  value 22K  [66.24.1344]  (hidden comment: 66.24.1344)
R4  value 100K  [66.24.1346]  (hidden comment: 66.24.1346)
R5  value 22K  [66.24.1344]  (hidden comment: 66.24.1344)
R6  value 100K  [66.24.1346]  (hidden comment: 66.24.1346)
R9  value 0R OR NC  [66.24.1337]  (hidden comment: 66.24.1337)
R10  value 22R  [66.24.1343]  (hidden comment: 66.24.1343)
R11  value 22R  [66.24.1343]  (hidden comment: 66.24.1343)
R12  value 22R  [66.24.1343]  (hidden comment: 66.24.1343)
R13  value 0R  [66.24.1337]  (hidden comment: 66.24.1337)
R14  value 22R  [66.24.1343]  (hidden comment: 66.24.1343)
R15  value 22R  [66.24.1343]  (hidden comment: 66.24.1343)
R16  value 22R  [66.24.1343]  (hidden comment: 66.24.1343)
R17  value 22K  [66.24.1344]  (hidden comment: 66.24.1344)
R18  value 100K  [66.24.1346]  (hidden comment: 66.24.1346)
R19  value 100K  [66.24.1346]  (hidden comment: 66.24.1346)
R20  value 4K7  [66.24.1345]  (hidden comment: 66.24.1345)
R21  value 100K  [66.24.1346]  (hidden comment: 66.24.1346)
TP_1V8  TESTPOINT  [TESTPOINT-60MILS]  (value not drawn)
TP_CTS_0  TESTPOINT  [TESTPOINT-60MILS]  (value not drawn)
TP_CTS_1  TESTPOINT  [TESTPOINT-60MILS]  (value not drawn)
TP_IGT  TESTPOINT  [TESTPOINT-60MILS]  (value not drawn)
TP_PWR_IND  TESTPOINT  [TESTPOINT-60MILS]  (value not drawn)
TP_rfu  TESTPOINT  [TESTPOINT-60MILS]  (value not drawn)
TP_RTS_0  TESTPOINT  [TESTPOINT-60MILS]  (value not drawn)
TP_RTS_1  TESTPOINT  [TESTPOINT-60MILS]  (value not drawn)
TP_RXD0  TESTPOINT  [TESTPOINT-60MILS]  (value not drawn)
TP_RXD_1  TESTPOINT  [TESTPOINT-60MILS]  (value not drawn)
TP_TXD0  TESTPOINT  [TESTPOINT-60MILS]  (value not drawn)
TP_TXD_1  TESTPOINT  [TESTPOINT-60MILS]  (value not drawn)
TP_USB_DN  TESTPOINT  [TESTPOINT-60MILS]  (value not drawn)
TP_USB_DP  TESTPOINT  [TESTPOINT-60MILS]  (value not drawn)
TP_VCORE  TESTPOINT  [TESTPOINT-60MILS]  (value not drawn)
TP_VUSB  TESTPOINT  [TESTPOINT-60MILS]  (value not drawn)
U1  value EXS82-W  [24.12.0081]  (hidden comment: 24.12.0081)

### Ports
CCCLK, CCIO, CCRST, EMERG_RTS_1V8 (in), EXS82_RFU_GPIO6 (bidir), EXS82_RFU_GPIO7 (bidir), EXS82_RFU_I2CCLK (bidir), EXS82_RFU_I2CDAT (bidir), FST_SHDN_1V8 (in), GNSS_ANT, ON_SIGNAL (in), POWER_IND (out), RF_OUT, RXD0_1V8 (out), STATUS_1V8 (out), TXD0_1V8 (in), USB_D_N (bidir), USB_D_P (bidir), VUSB (in)

### Nets
1V8: C24.2 R17.1 TP_1V8.1(TP) U1.10(V180)
3V3: C11.2 C12.1 C13.2 C14.2 C15.2 C18.1 C19.1 C20.1 C21.2 C22.2 C23.2 Q1.2(S) R13.1 R19.2 U1.53(BATT+RF)
CCVCC: U1.20(CCVCC)
ExSx_CCGND: R9.1 U1.84(GND)
GND: C1.1 C2.1 C3.1 C4.2 C7.2 C8.2 C9.1 C10.1 C11.1 C12.2 C13.1 C14.1 C15.1 C16.1 C17.1 C18.2 C19.2 C20.2 C21.1 C22.1 C23.1 C24.1 C25.1 Q2.1(E2) Q2.4(E1) Q3.4(E1) R1.1 R4.1 R6.1 R9.2 R18.1 R21.1 U1.4(GND) U1.6(GND) U1.9(GND) U1.34(GND) U1.47(GND) U1.48(GND) U1.49(GND) U1.50(GND) U1.51(GND) U1.52(GND) U1.54(GND) U1.55(GND) U1.57(GND) U1.58(GND) U1.60(GND) U1.61(GND) U1.62(GND) U1.63(GND) U1.64(GND) U1.81(GND) U1.82(GND) U1.83(GND) U1.85(GND) U1.86(GND) U1.88(GND) U1.89(GND) U1.90(GND) U1.92(GND) U1.93(GND) U1.94(GND) U1.95(GND) U1.96(GND) U1.97(GND) U1.98(GND) U1.99(GND) U1.100(GND) U1.101(GND) U1.102(GND) U1.103(GND) U1.104(GND) U1.105(GND) U1.245(GND) U1.250(GND) U1.251(GND) U1.252(GND)
VCORE: C25.2 R20.1 TP_VCORE.1(TP) U1.22(VCORE)
CCCLK: U1.21(CCCLK) ; port CCCLK
CCIO: U1.19(CCIO) ; port CCIO
CCRST: U1.17(CCRST) ; port CCRST
EMERG_RTS: C2.2 Q2.6(C2) U1.33(EMERG_RST)
EMERG_RTS_1V8: R3.1 ; port EMERG_RTS_1V8
EXS82_RFU_GPIO6: C17.2 R16.2 ; port EXS82_RFU_GPIO6
EXS82_RFU_GPIO7: C16.2 R15.2 ; port EXS82_RFU_GPIO7
EXS82_RFU_I2CCLK: C8.1 R14.2 ; port EXS82_RFU_I2CCLK
EXS82_RFU_I2CDAT: C7.1 R10.2 ; port EXS82_RFU_I2CDAT
FST_SHDN: C3.2 Q2.3(C1) U1.40(FST_SHDN)
FST_SHDN_1V8: R5.1 ; port FST_SHDN_1V8
GNSS_ANT: U1.56(GNSS_ANT) ; port GNSS_ANT
ON: C1.2 Q1.3(D) R1.2 TP_IGT.1(TP) U1.8(ON)
ON_SIGNAL: R2.1 ; port ON_SIGNAL
POWER_IND: Q3.6(C2) R19.1 TP_PWR_IND.1(TP) ; port POWER_IND
RF_OUT: U1.59(RF_OUT) ; port RF_OUT
RXD0: R12.1 TP_RXD0.1(TP) U1.11(RXD0)
RXD0_1V8: C10.2 R12.2 ; port RXD0_1V8
STATUS_1V8: U1.39(STATUS) ; port STATUS_1V8
TXD0: R11.1 TP_TXD0.1(TP) U1.13(TXD0)
TXD0_1V8: C9.2 R11.2 ; port TXD0_1V8
USB_D_N: TP_USB_DN.1(TP) U1.46(USB_ON) ; port USB_D_N
USB_D_P: TP_USB_DP.1(TP) U1.45(USB_DP) ; port USB_D_P
VUSB: C4.1 TP_VUSB.1(TP) U1.44(VUSB_IN) ; port VUSB
NetQ1_1: Q1.1(G) R2.2
NetQ2_2: Q2.2(B2) R3.2 R4.2
NetQ2_5: Q2.5(B1) R5.2 R6.2
NetQ3_1: Q3.1(E2) Q3.3(C1)
NetQ3_2: Q3.2(B2) R17.2 R18.2
NetQ3_5: Q3.5(B1) R20.2 R21.2
NetR10_1: R10.1 U1.27(rfu_(I2CDAT))
NetR13_2: R13.2 U1.5(BATT+BB)
NetR14_1: R14.1 U1.28(rfu_(I2CCLK))
NetR15_1: R15.1 U1.37(rfu_(GPIO7/PWM1))
NetR16_1: R16.1 U1.38(rfu_(GPIO6/PWM2))
NetTP_CTS_0_1: TP_CTS_0.1(TP) U1.12(CTS0)
NetTP_CTS_1_1: TP_CTS_1.1(TP) U1.32(CTS1)
NetTP_rfu_1: TP_rfu.1(TP) U1.3(rfu_(dnu))
NetTP_RTS_0_1: TP_RTS_0.1(TP) U1.15(RTS0)
NetTP_RTS_1_1: TP_RTS_1.1(TP) U1.31(RTS1)
NetTP_RXD_1_1: TP_RXD_1.1(TP) U1.30(RXD1)
NetTP_TXD_1_1: TP_TXD_1.1(TP) U1.29(TXD1)

Not connected (* = marked no-connect by the designer): U1 1(rfu(GNSS_LNA_EN))* 2(SUSPEND_MON)* 7(ADC1)* 14(RING0)* 16(NC)* 18(CCIN) 23(rfu_(TXDDAI))* 24(rfu_(TFSDAI))* 25(rfu_(RXDDAI))* 26(rfu_(SCLK))* 35(NC)* 36(SIM_SWITCH)* 41(DSR0)* 42(DCD0)* 43(DTR0)* 65(rfu_(dnu))* 66(rfu_(dnu))* 67(NC)* 68(NC)* 69(NC)* 70(NC)* 71(NC)* 72(NC)* 73(NC)* 74(rfu_(dnu))* 75(rfu_(dnu))* 76(rfu_(dnu))* 77(rfu_(dnu))* 78(rfu_(dnu))* 79(NC)* 80(NC)* 87(rfu_(dnu))* 91(NC)* 106(rfu_(CC2_VPP))* 246(rfu(CC2_VCC))* 247(rfu(CC2_CLK))* 248(rfu(CC2_IO))* 249(rfu(CC2_RST))*

### Layout directives
differential pair; rule Differential Pairs Routing [Pref Gap = 16mil    Min Gap  = 16mil    Max Gap  = 16milPref Width = 24.2mil    Min Width  = 24.2mil    Max Width  = 24.2mil]: USB_D_P
differential pair; rule Differential Pairs Routing [Pref Gap = 16mil    Min Gap  = 16mil    Max Gap  = 10milPref Width = 24.2mil    Min Width  = 24.2mil    Max Width  = 24.2mil]: USB_D_N

### Notes on the sheet
- 90 OHMS DIFFERENTIAL
- 60.15.0027
- PLACA IMPRESSA MONTADA PROCESSAMENTO E CONTROLE IOT
- 030
- 00
- 60.15.0027_030_Rev00
- A2
- 02/07
- 1
- 2
- 3
- 4
- 5
- 6
- 7
- 8
- A
- B
- C
- D
- E
- F
- G
- H
- DOCUMENTO DE ENGENHARIA DE PRODUTO
- DOCUMENT OF PRODUCT ENGINEERING
- CÓDIGO / CODE
- DESCRIÇÃO / DESCRIPTION
- DOC
- REV
- ARQUIVO / FILE
- FORM./SIZE
- FOLHA / PAGE
- (in symbol 16.23.0789) 150uF
- (in symbol 16.23.0795) 47uF
- (in symbol 16.23.0797) 33pF
- (in symbol 16.23.0798) 47pF
- (in symbol 16.23.0799) 10pF
- (in symbol 16.23.0802) 39pF or NC; 39pF
- (in symbol 16.23.0803) 100nF
- (in symbol 24.12.0081) CONTROL; RF; ADC; SIM; USB; ASC1; ASC0; POWER
- (in symbol 72.19.0071) NX3008PBKMB
- (in symbol 72.26.0005) BC847CDW1T1G

### Library data of the parts
C1-C3 C24 C25 = 16.23.0798: CAPACITOR CERAMICO 47pF 10V 5% C0G SMD 0201
C4 = 16.23.0803: as C30 on sheet 5-MCU
C7-C10 C16 C17 = 16.23.0802: CAPACITOR CERAMICO 39pF 100V 5% C0G SMD 0201
C11 = 16.23.0804: CAPACITOR CERAMICO 100uF 6.3V 10%% X5R SMD 1206
C12 C19 C20 = 16.23.0795: CERAMICO 47uF 10% 6.3V X5R SMD 1206
C13 C14 C21 C22 = 16.23.0797: CAPACITOR CERAMICO 33pF 10V 5% C0G SMD 0201
C15 C23 = 16.23.0799: CAPACITOR CERAMICO 10pF 25V 5% C0G SMD 0201
C18 = 16.23.0789: CAPACITOR CERAMICO 150uF 20% 6.3V X5R SMD 1206
Q1 = 72.19.0071: MOSFET CANAL P SMD 30V 230mA SOT883B
Q2 Q3 = 72.26.0005: TRANSISTOR DUPLO NPN BC847 SMD SOT363
R1 R4 R6 R18 R19 R21 = 66.24.1346: as R36 on sheet 7-Level Converter
R2 = 66.24.1342: RESISTOR THICK FILM 50mW 100 OHMS 1% SMD 0201
R3 R5 R17 = 66.24.1344: RESISTOR THICK FILM 50mW 22K OHMS 1% SMD 0201
R9 R13 = 66.24.1337: RESISTOR THICK FILM 0,1W 0 OHMS SMD 0603
R10-R12 R14-R16 = 66.24.1343: RESISTOR THICK FILM 50mW 22 OHMS 1% SMD 0201
R20 = 66.24.1345: RESISTOR THICK FILM 50mW 4K7 OHMS 1% SMD 0201
TP_1V8 TP_CTS_0 TP_CTS_1 TP_IGT TP_PWR_IND TP_rfu TP_RTS_0 TP_RTS_1 TP_RXD0 TP_RXD_1 TP_TXD0 TP_TXD_1 TP_USB_DN TP_USB_DP TP_VCORE TP_VUSB = TESTPOINT-60MILS: PONTO DE TESTE PARA CAMA DE PREGO
U1 = 24.12.0081: CIRCUITO INTEGRADO DIG MOD COMUNICACAO MULTI REDES EXS82-W

## Sheet 6-Power Supply.SchDoc
size 594 x 420 mm; SheetNumber: 6; SheetTotal: 7; PageSetup: Record=PageOptions|CenterHorizontal=False|CenterVertical=False|PrintScale=0.43|XCorrection=0.00|YCorrection=0.00|PrintKind=1|BorderSize=5000000|LeftOffset=0|BottomOffset=0|Orientation=2|PaperLength=5940|PaperWidth=4200|Scale=100|PaperSource=7|PrintQuality=-4|MediaType=1|DitherType=10|PaperKind=Personal. 1: 215,9 x 279,4 mm|PrintScaleMode=0; NumTotalFolhas: 7; NumFolha: 6
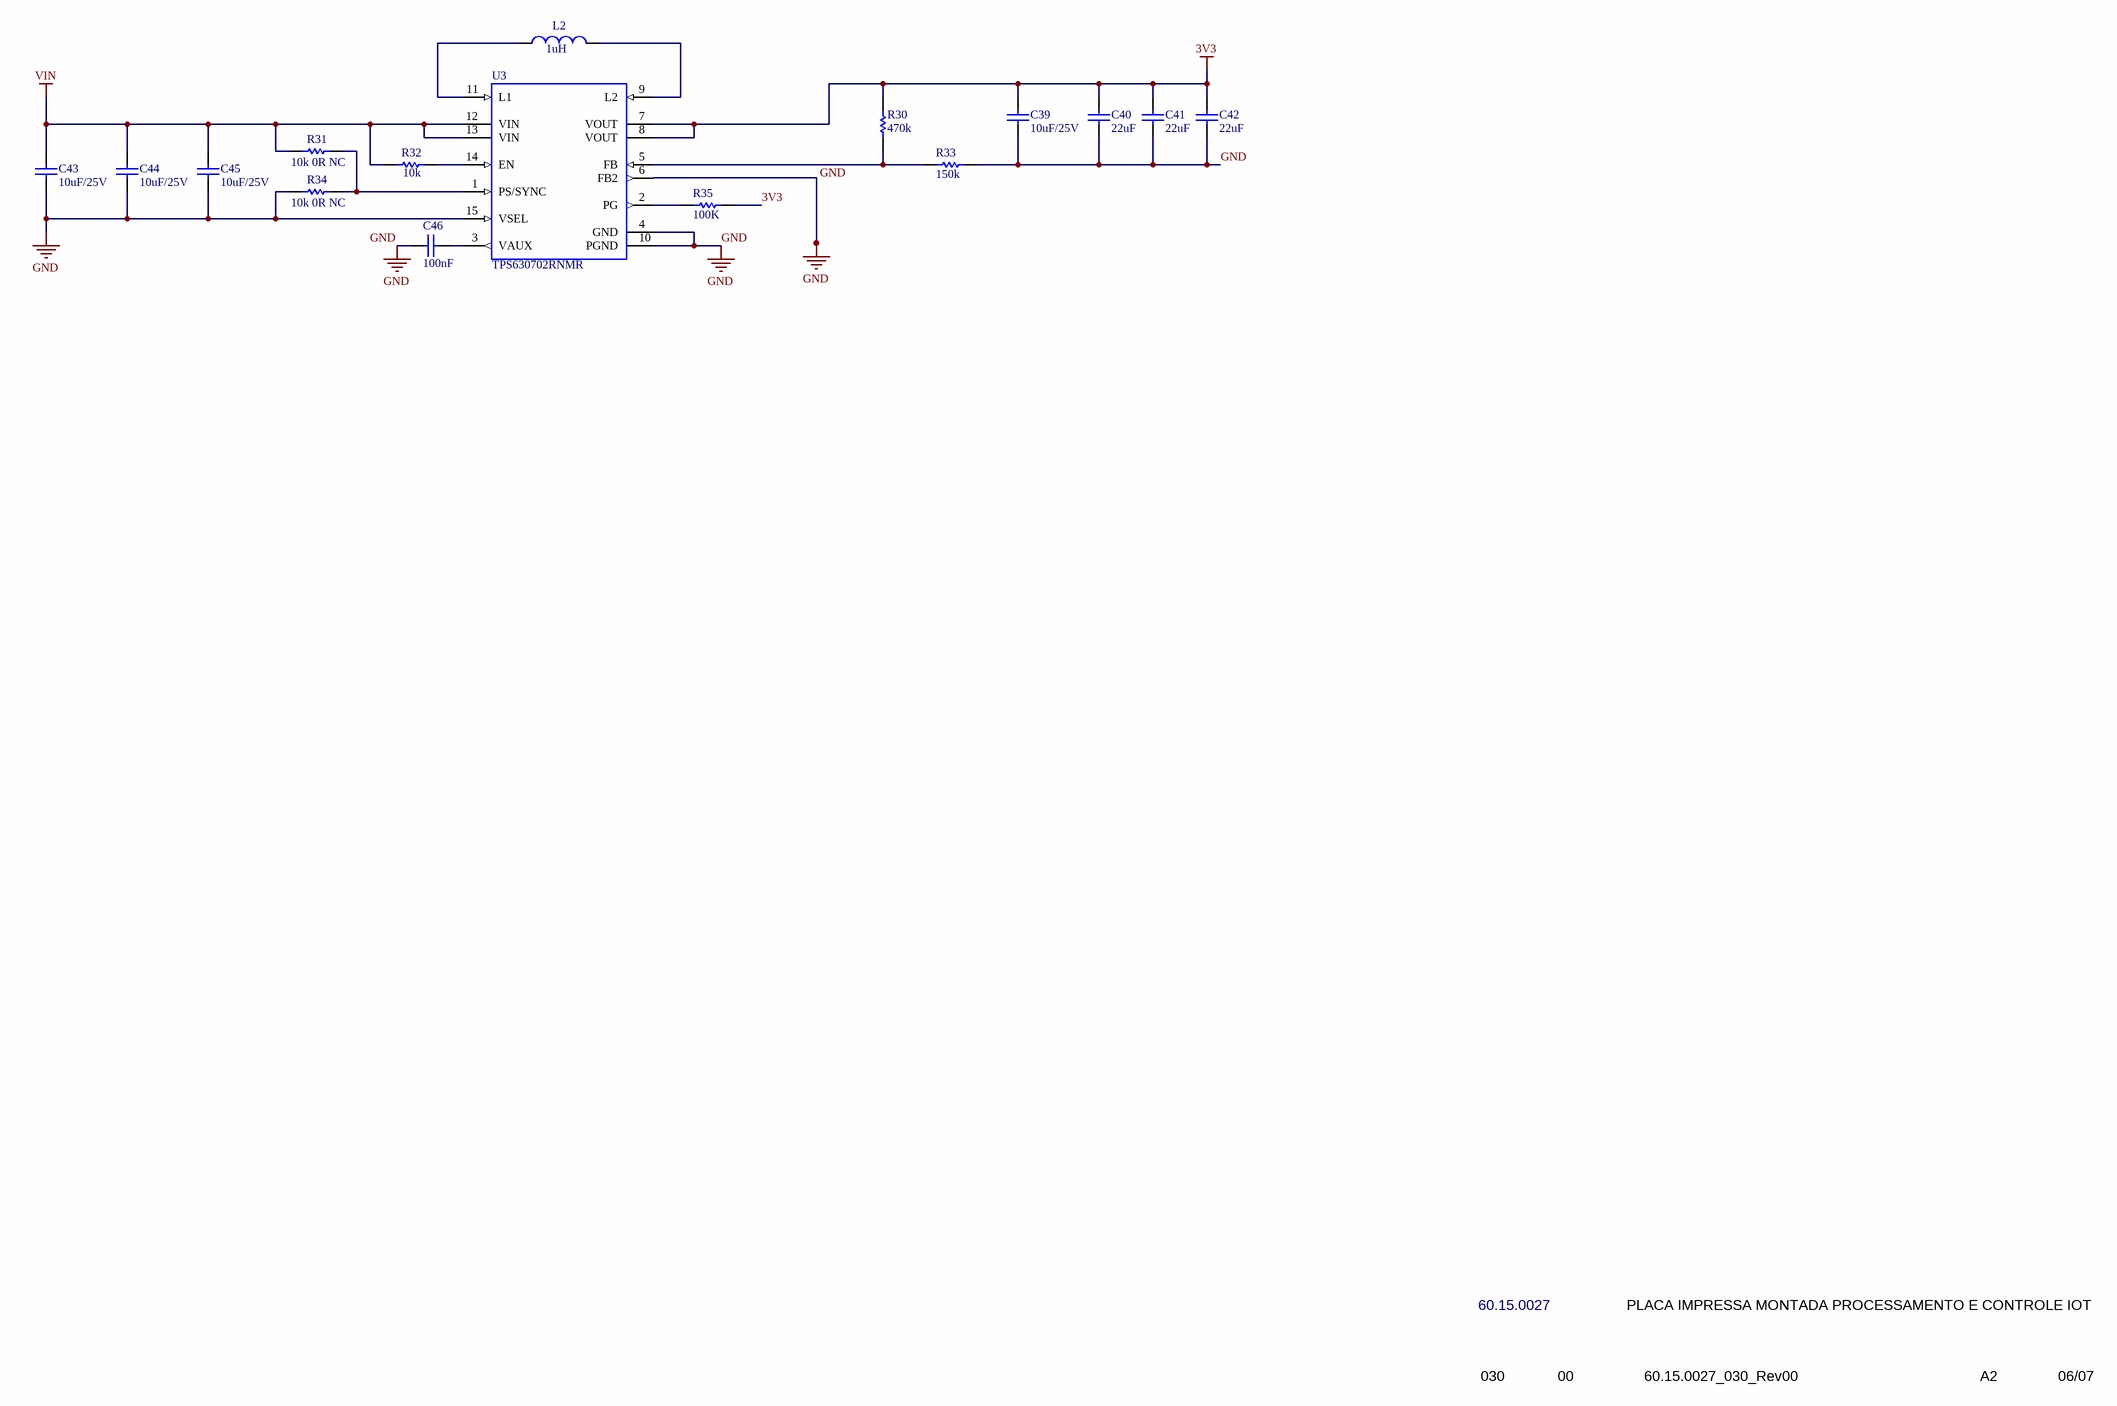
[diagram p7: 6-Power Supply.SchDoc]

### Parts
C39  value 10uF/25V  [16.23.0733]  (hidden comment: 16.23.0733)
C40  16.23.0428  [16.23.0428]  (value not drawn)
C41  16.23.0428  [16.23.0428]  (value not drawn)
C42  16.23.0428  [16.23.0428]  (value not drawn)
C43  value 10uF/25V  [16.23.0735]  (hidden comment: 16.23.0735)
C44  value 10uF/25V  [16.23.0735]  (hidden comment: 16.23.0735)
C45  value 10uF/25V  [16.23.0733]  (hidden comment: 16.23.0733)
C46  value 100nF  [16.23.0807]  (hidden comment: 16.23.0807)
L2  value 1uH  [40.12.0346]  (hidden comment: 40.12.0346)
R30  value 470k  [66.21.1644]  (hidden comment: 66.21.1644)
R31  value 10k 0R NC  [66.21.1646]  (hidden comment: 66.21.1646)
R32  value 10k  [66.21.1646]  (hidden comment: 66.21.1646)
R33  value 150k  [66.21.1645]  (hidden comment: 66.21.1645)
R34  value 10k 0R NC  [66.21.1646]  (hidden comment: 66.21.1646)
R35  value 100K  [66.24.1346]  (hidden comment: 66.24.1346)
U3  value TPS630702RNMR  [26.24.0200]  (hidden comment: 26.24.0200)

### Nets
3V3: C39.2 C40.2 C41.2 C42.2 R30.2 R35.2 U3.7(VOUT) U3.8(VOUT)
GND: C39.1 C40.1 C41.1 C42.1 C43.1 C44.1 C45.1 C46.1 R33.2 R34.1 U3.4(GND) U3.6(FB2) U3.10(PGND) U3.15(VSEL)
VIN: C43.2 C44.2 C45.2 R31.1 R32.1 U3.12(VIN) U3.13(VIN)
NetC46_2: C46.2 U3.3(VAUX)
NetL2_1: L2.1 U3.11(L1)
NetL2_2: L2.2 U3.9(L2)
NetR30_1: R30.1 R33.1 U3.5(FB)
NetR31_2: R31.2 R34.2 U3.1(PS/SYNC)
NetR32_2: R32.2 U3.14(EN)
NetR35_1: R35.1 U3.2(PG)

### Notes on the sheet
- 60.15.0027
- PLACA IMPRESSA MONTADA PROCESSAMENTO E CONTROLE IOT
- 030
- 00
- 60.15.0027_030_Rev00
- A2
- 06/07
- Labels drawn without touching a wire or pin: GND
- 1
- 2
- 3
- 4
- 5
- 6
- 7
- 8
- A
- B
- C
- D
- E
- F
- G
- H
- DOCUMENTO DE ENGENHARIA DE PRODUTO
- DOCUMENT OF PRODUCT ENGINEERING
- CÓDIGO / CODE
- DESCRIÇÃO / DESCRIPTION
- DOC
- REV
- ARQUIVO / FILE
- FORM./SIZE
- FOLHA / PAGE
- (in symbol 16.23.0428) 22uF

### Library data of the parts
C39 C45 = 16.23.0733: CAPACITOR CERAMICO MULTICAMADAS 10uF 25V 20% SMD 0603 X5R; Part Number: GRM188R61E106MA73; Fabricante: Murata
C40-C42 = 16.23.0428: CC MUL 22uF 16V X5R 20% SMD 0805
C43 C44 = 16.23.0735: CAPACITOR CERAMICO MULTICAMADAS 10uF 25V 10% SMD 0805 X5R; Part Number: GRM21BR61E106KA73; Fabricante: Murata
C46 = 16.23.0807: CAPACITOR CERAMICO MULTICAMADAS 100nF 50V X7R 10% SMD 0402
L2 = 40.12.0346: INDUTOR FIXO 1uH 20% 5A 36mOHM SMD 1008
R30 = 66.21.1644: RESISTOR THICK FILM 470k OHMS 25V 0.05W 1% SMD 0201
R31 R32 R34 = 66.21.1646: as R22 on sheet 5-MCU
R33 = 66.21.1645: RESISTOR THICK FILM 150k OHMS 25V 0.05W 1% SMD 0201
R35 = 66.24.1346: as R36 on sheet 7-Level Converter
U3 = 26.24.0200: CI REGULADOR TENSAO CHAV AJUST 2A16V 2A DESC SAIDA VQFN-HR

## Sheet 4-Antennas.SchDoc
size 594 x 420 mm; SheetNumber: 4; SheetTotal: 7; PageSetup: Record=PageOptions|CenterHorizontal=False|CenterVertical=False|PrintScale=0.43|XCorrection=0.00|YCorrection=0.00|PrintKind=1|BorderSize=5000000|LeftOffset=0|BottomOffset=0|Orientation=2|PaperLength=5940|PaperWidth=4200|Scale=100|PaperSource=7|PrintQuality=-4|MediaType=1|DitherType=10|PaperKind=Personal. 1: 215,9 x 279,4 mm|PrintScaleMode=0; NumTotalFolhas: 7; NumFolha: 4
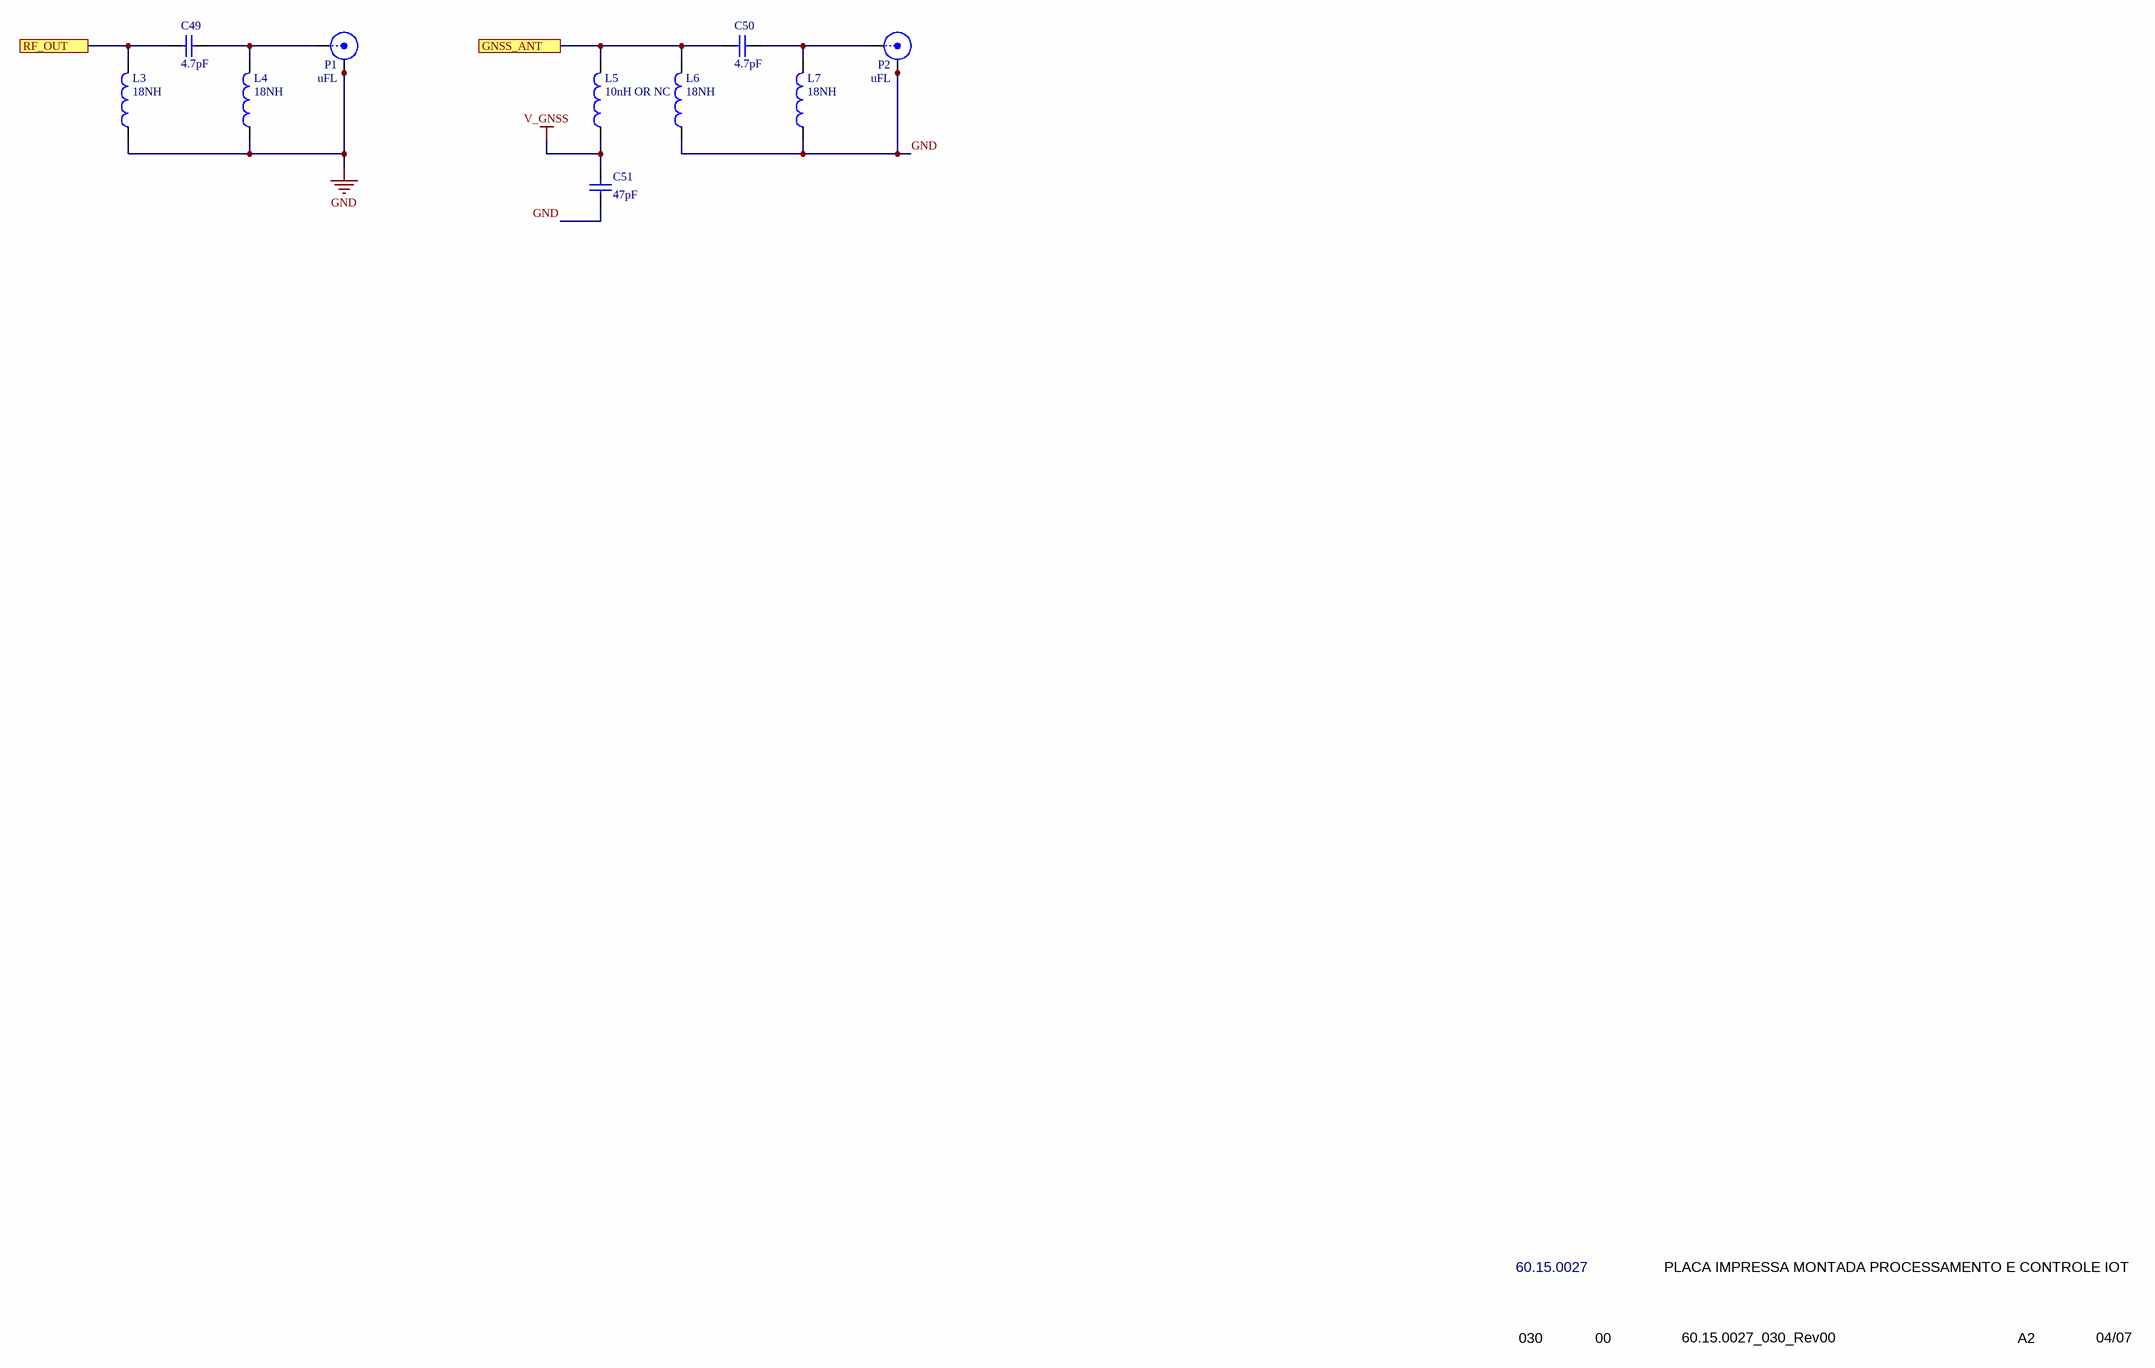
[diagram p8: 4-Antennas.SchDoc]

### Parts
C49  16.23.0788  [16.23.0788]  (value not drawn)
C50  16.23.0788  [16.23.0788]  (value not drawn)
C51  16.23.0798  [16.23.0798]  (value not drawn)
L3  value 18NH  [40.12.0345]  (hidden comment: 40.12.0345)
L4  value 18NH  [40.12.0345]  (hidden comment: 40.12.0345)
L5  value 10nH OR NC  [40.12.0348]  (hidden comment: 40.12.0348)
L6  value 18NH  [40.12.0345]  (hidden comment: 40.12.0345)
L7  value 18NH  [40.12.0345]  (hidden comment: 40.12.0345)
P1  value uFL  [28.20.0019]  (hidden comment: 28.20.0019)
P2  value uFL  [28.20.0019]  (hidden comment: 28.20.0019)

### Ports
GNSS_ANT, RF_OUT

### Nets
GND: C51.1 L3.1 L4.1 L6.1 L7.1 P1.2(GND) P1.3(GND) P2.2(GND) P2.3(GND)
V_GNSS: C51.2 L5.1
GNSS_ANT: C50.2 L5.2 L6.2 ; port GNSS_ANT
RF_OUT: C49.2 L3.2 ; port RF_OUT
NetC49_1: C49.1 L4.2 P1.1(SIG)
NetC50_1: C50.1 L7.2 P2.1(SIG)

### Notes on the sheet
- 60.15.0027
- PLACA IMPRESSA MONTADA PROCESSAMENTO E CONTROLE IOT
- 030
- 00
- 60.15.0027_030_Rev00
- A2
- 04/07
- 1
- 2
- 3
- 4
- 5
- 6
- 7
- 8
- A
- B
- C
- D
- E
- F
- G
- H
- DOCUMENTO DE ENGENHARIA DE PRODUTO
- DOCUMENT OF PRODUCT ENGINEERING
- CÓDIGO / CODE
- DESCRIÇÃO / DESCRIPTION
- DOC
- REV
- ARQUIVO / FILE
- FORM./SIZE
- FOLHA / PAGE
- (in symbol 16.23.0788) 4.7pF
- (in symbol 16.23.0798) 47pF

### Library data of the parts
C49 C50 = 16.23.0788: CAPACITOR CERAMICO MULTICAMADA 4.7PF 50V C0G/NP0 0402
C51 = 16.23.0798: as C1 on sheet 2-EXS82
L3 L4 L6 L7 = 40.12.0345: INDUTOR FIXO 18NH 370MA 270 MOHM 0402
L5 = 40.12.0348: INDUTOR FIXO 10nH 3% 500mA 260mOHM 0402; Manufactor: MURATA; Part Number: LQG15HS10NH02D
P1 P2 = 28.20.0019: CONECTOR MICRO COAXIAL 50 OHM SMD

## Sheet 3-Sim Card.SchDoc
size 594 x 420 mm; SheetNumber: 3; SheetTotal: 7; PageSetup: Record=PageOptions|CenterHorizontal=False|CenterVertical=False|PrintScale=0.43|XCorrection=0.00|YCorrection=0.00|PrintKind=1|BorderSize=5000000|LeftOffset=0|BottomOffset=0|Orientation=2|PaperLength=5940|PaperWidth=4200|Scale=100|PaperSource=7|PrintQuality=-4|MediaType=1|DitherType=10|PaperKind=Personal. 1: 215,9 x 279,4 mm|PrintScaleMode=0; NumTotalFolhas: 7; NumFolha: 3
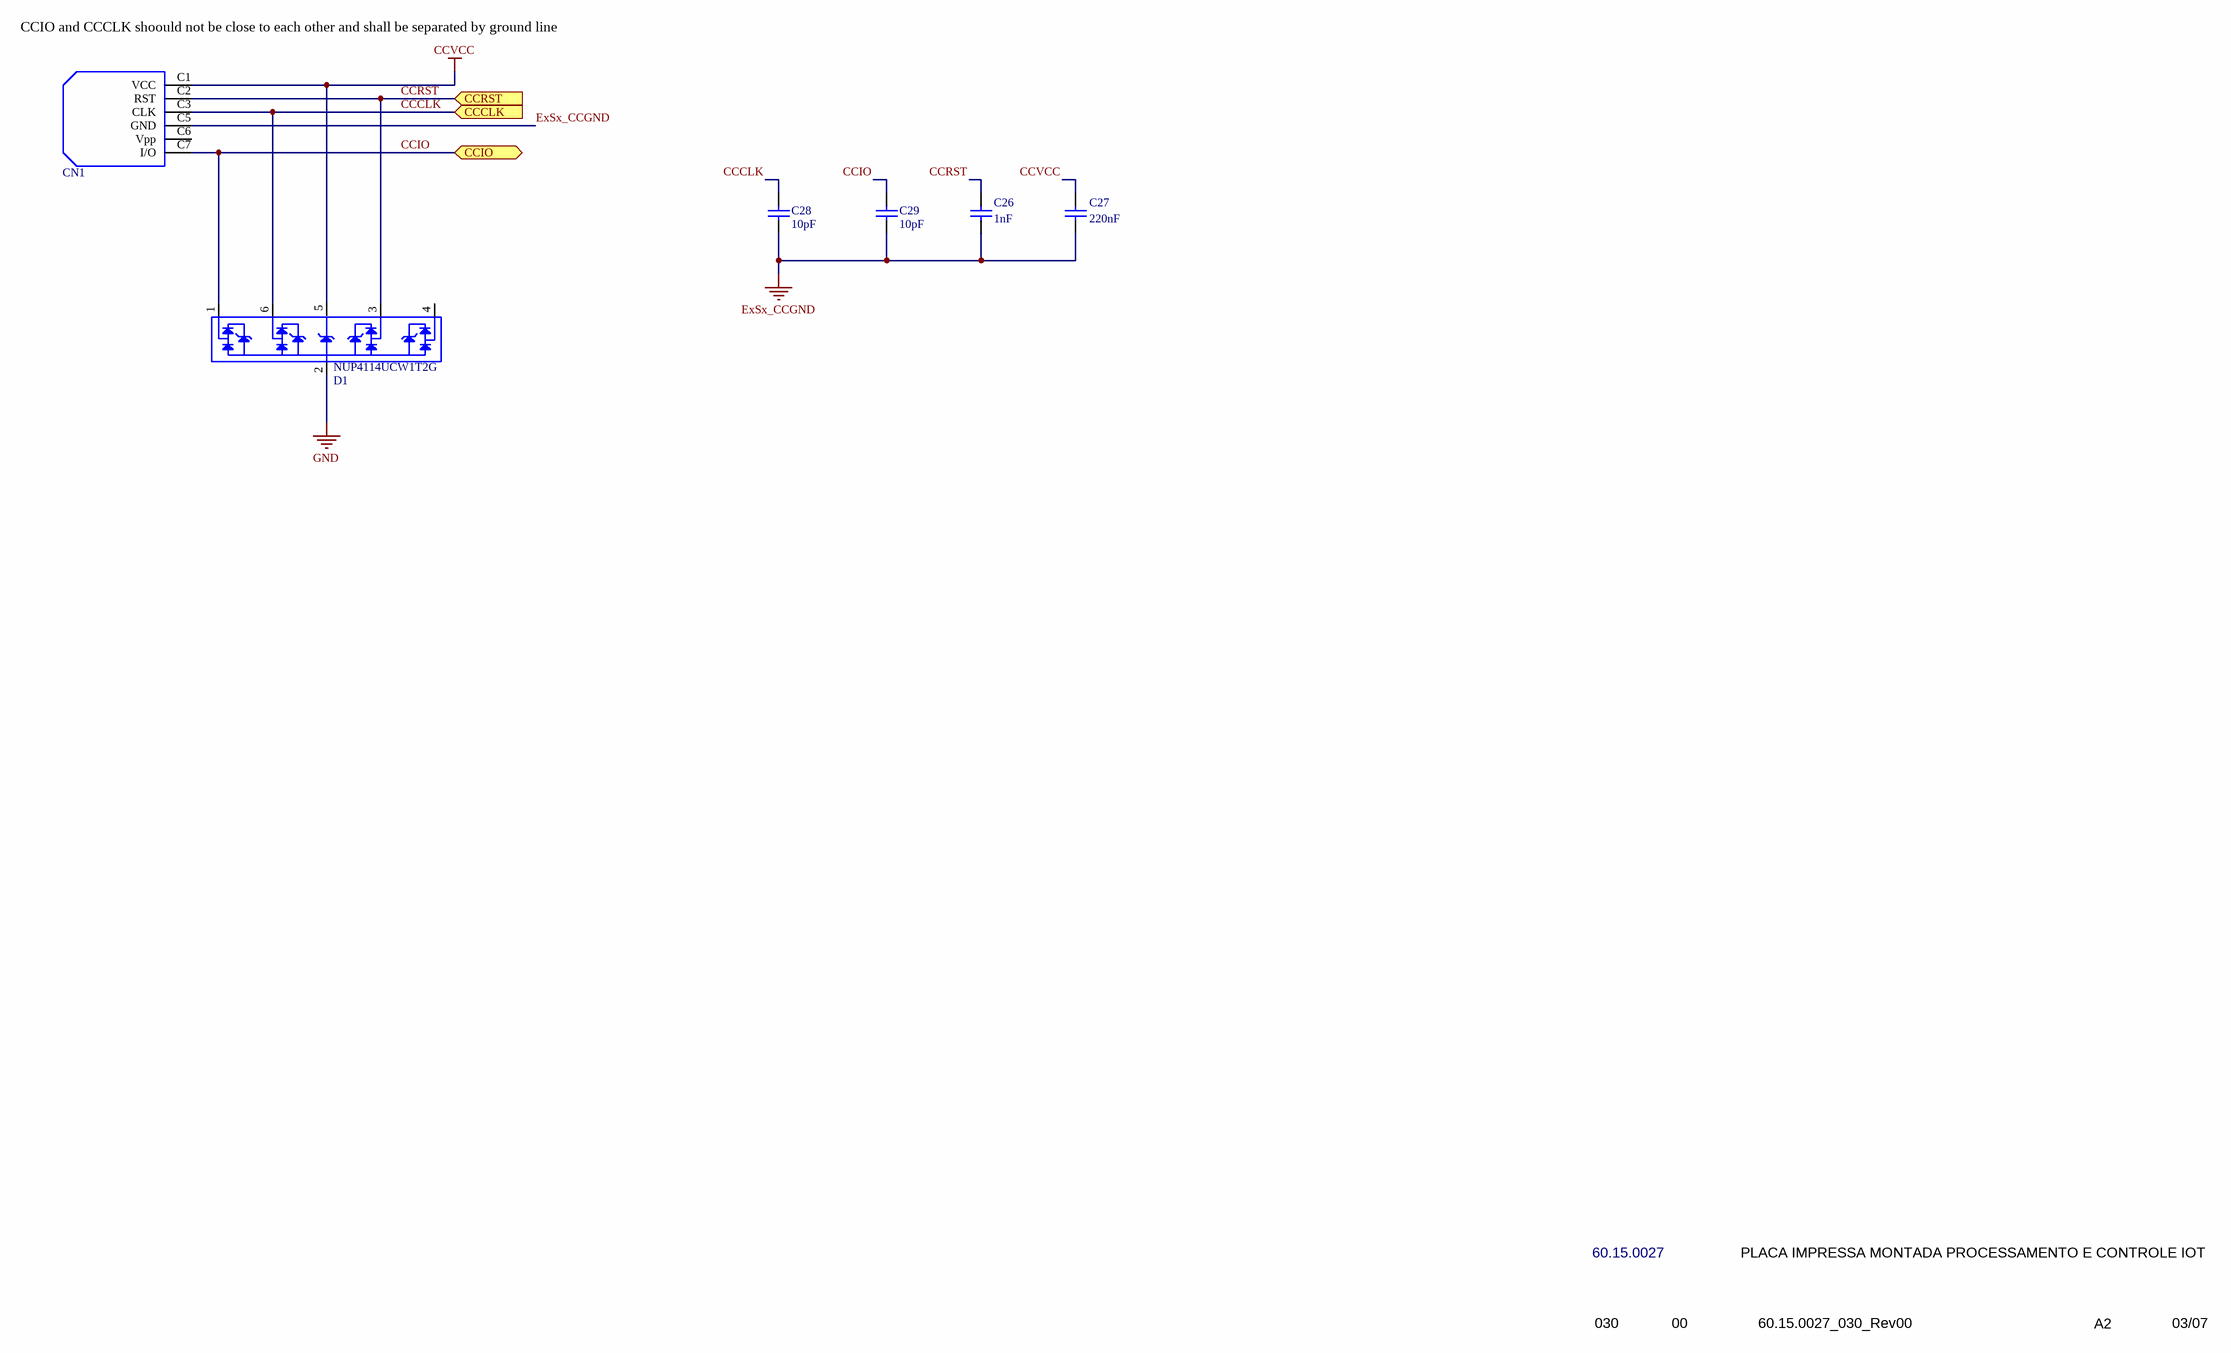
[diagram p9: 3-Sim Card.SchDoc]

### Parts
C26  16.23.0800  [16.23.0800]  (value not drawn)
C27  16.23.0801  [16.23.0801]  (value not drawn)
C28  16.23.0799  [16.23.0799]  (value not drawn)
C29  16.23.0799  [16.23.0799]  (value not drawn)
CN1  SIMCARD-6X6  [28.24.0073]  (value not drawn)
D1  32.27.0043  [32.27.0043]  (value not drawn)

### Ports
CCCLK (in), CCIO (bidir), CCRST (in)

### Nets
CCVCC: C27.2 CN1.C1(VCC) D1.5
ExSx_CCGND: C26.1 C27.1 C28.1 C29.1 CN1.C5(GND)
GND: D1.2
CCCLK: C28.2 CN1.C3(CLK) D1.6 ; port CCCLK
CCIO: C29.2 CN1.C7(I/O) D1.1 ; port CCIO
CCRST: C26.2 CN1.C2(RST) D1.3 ; port CCRST

Not connected (* = marked no-connect by the designer): CN1 C6(Vpp); D1 4

### Notes on the sheet
- (near CN1) CCIO and CCCLK shoould not be close to each other and shall be separated by ground line
- 60.15.0027
- PLACA IMPRESSA MONTADA PROCESSAMENTO E CONTROLE IOT
- 030
- 00
- 60.15.0027_030_Rev00
- A2
- 03/07
- 1
- 2
- 3
- 4
- 5
- 6
- 7
- 8
- A
- B
- C
- D
- E
- F
- G
- H
- DOCUMENTO DE ENGENHARIA DE PRODUTO
- DOCUMENT OF PRODUCT ENGINEERING
- CÓDIGO / CODE
- DESCRIÇÃO / DESCRIPTION
- DOC
- REV
- ARQUIVO / FILE
- FORM./SIZE
- FOLHA / PAGE
- (in symbol 16.23.0799) 10pF
- (in symbol 16.23.0800) 1nF
- (in symbol 16.23.0801) 220nF
- (in symbol 32.27.0043) NUP4114UCW1T2G

### Library data of the parts
C26 = 16.23.0800: CAPACITOR CERAMICO 1nF 25V 5% X7R SMD 0201
C27 = 16.23.0801: CAPACITOR CERAMICO 220nF 16V 10% X5R SMD 0201
C28 C29 = 16.23.0799: as C15 on sheet 2-EXS82
CN1 = 28.24.0073: CONECTOR FM NANO-D 6 VIAS - BRONZE
D1 = 32.27.0043: DIODO SUPRESSOR 5.5V 10V SC88

## Nets that join several sheets
1V8: 1-Main (J20.1), 7-Level Converter (C48.2 U4.22 U4.23), 2-EXS82 (C24.2 R17.1 TP_1V8.1 U1.10)
3V3: 1-Main (J2.1), 5-MCU (12 pins), 7-Level Converter (C47.2 R36.1 R38.2 U4.24), 2-EXS82 (15 pins), 6-Power Supply (8 pins)
CCVCC: 2-EXS82 (U1.20), 3-Sim Card (C27.2 CN1.C1 D1.5)
ExSx_CCGND: 2-EXS82 (R9.1 U1.84), 3-Sim Card (5 pins)
GND: 1-Main (J1.1 J24.1 J25.1 J48.1), 5-MCU (15 pins), 7-Level Converter (5 pins), 2-EXS82 (77 pins), 6-Power Supply (14 pins), 4-Antennas (9 pins), 3-Sim Card (D1.2)
MCU_VDDA: 1-Main (J40.1), 5-MCU (R25.1 R26.1 R28.2)
MCU_VREF+: 1-Main (J39.1), 5-MCU (R27.1 R28.1)
V_GNSS: 1-Main (J26.1), 4-Antennas (C51.2 L5.1)
VIN: 1-Main (J46.1 J47.1), 6-Power Supply (7 pins)
BLE_RX: 1-Main (J19.1), 5-MCU (U2.40)
BLE_TX: 1-Main (J18.1), 5-MCU (U2.39)
CCCLK: 2-EXS82 (U1.21), 3-Sim Card (C28.2 CN1.C3 D1.6)
CCIO: 2-EXS82 (U1.19), 3-Sim Card (C29.2 CN1.C7 D1.1)
CCRST: 2-EXS82 (U1.17), 3-Sim Card (C26.2 CN1.C2 D1.3)
EMERG_RTS_1V8: 7-Level Converter (U4.16), 2-EXS82 (R3.1)
EMERG_RTS_3V3: 5-MCU (U2.20), 7-Level Converter (U4.6)
EXS82_RFU_GPIO6: 1-Main (J35.1), 2-EXS82 (C17.2 R16.2)
EXS82_RFU_GPIO7: 1-Main (J36.1), 2-EXS82 (C16.2 R15.2)
EXS82_RFU_I2CCLK: 1-Main (J38.1), 2-EXS82 (C8.1 R14.2)
EXS82_RFU_I2CDAT: 1-Main (J37.1), 2-EXS82 (C7.1 R10.2)
FST_SHDN_1V8: 7-Level Converter (U4.14), 2-EXS82 (R5.1)
FST_SHDN_3V3: 5-MCU (U2.4), 7-Level Converter (U4.8)
GNSS_ANT: 2-EXS82 (U1.56), 4-Antennas (C50.2 L5.2 L6.2)
I2C1_SCL: 1-Main (J16.1), 5-MCU (U2.42)
I2C1_SDA: 1-Main (J17.1), 5-MCU (U2.43)
MCU_BOOT: 1-Main (J21.1), 5-MCU (R22.1)
MCU_NRST: 1-Main (J13.1), 5-MCU (U2.7)
MCU_PA0: 1-Main (J30.1), 5-MCU (U2.10)
MCU_PA1: 1-Main (J31.1), 5-MCU (U2.11)
MCU_PA8: 1-Main (J29.1), 5-MCU (U2.29)
MCU_PA11: 1-Main (J28.1), 5-MCU (U2.32)
MCU_PA12: 1-Main (J27.1), 5-MCU (U2.33)
MCU_PA15: 1-Main (J9.1), 5-MCU (U2.38)
MCU_PB5: 1-Main (J6.1), 5-MCU (U2.41)
MCU_PB8: 1-Main (J22.1), 5-MCU (U2.45)
MCU_PB9: 1-Main (J23.1), 5-MCU (U2.46)
MCU_PH0: 1-Main (J41.1), 5-MCU (U2.5)
MCU_PH1: 1-Main (J42.1), 5-MCU (U2.6)
MCU_STATUS: 1-Main (J45.1), 5-MCU (Q4.1 U2.14)
MCU_SWCLK: 1-Main (J15.1), 5-MCU (U2.37)
MCU_SWDIO: 1-Main (J14.1), 5-MCU (U2.34)
nOE_LVL_CONV: 5-MCU (U2.3), 7-Level Converter (R36.2 U4.21)
ON_SIGNAL: 5-MCU (U2.25), 2-EXS82 (R2.1)
POWER_IND: 5-MCU (U2.19), 2-EXS82 (Q3.6 R19.1 TP_PWR_IND.1)
RF_OUT: 2-EXS82 (U1.59), 4-Antennas (C49.2 L3.2)
RXD0_1V8: 7-Level Converter (U4.19), 2-EXS82 (C10.2 R12.2)
RXD1_3V3: 5-MCU (U2.31), 7-Level Converter (U4.3)
SDA_Sensor: 1-Main (J7.1), 5-MCU (U2.22)
SLC_Sensor: 1-Main (J8.1), 5-MCU (U2.21)
SPI1_MISO: 1-Main (J4.1), 5-MCU (U2.16)
SPI1_MOSI: 1-Main (J5.1), 5-MCU (U2.17)
SPI1_SCK: 1-Main (J3.1), 5-MCU (U2.15)
SPI2_MISO: 1-Main (J11.1), 5-MCU (U2.27)
SPI2_MOSI: 1-Main (J12.1), 5-MCU (U2.28)
SPI2_SCK: 1-Main (J10.1), 5-MCU (U2.26)
STATUS_1V8: 7-Level Converter (U4.20), 2-EXS82 (U1.39)
STATUS_3V3: 5-MCU (U2.18), 7-Level Converter (U4.2)
TXD0_1V8: 7-Level Converter (U4.13), 2-EXS82 (C9.2 R11.2)
TXD1_3V3: 5-MCU (U2.30), 7-Level Converter (U4.9)
USART2_RX: 1-Main (J44.1), 5-MCU (U2.13)
USART2_TX: 1-Main (J43.1), 5-MCU (U2.12)
USB_D_N: 1-Main (J32.1), 2-EXS82 (TP_USB_DN.1 U1.46)
USB_D_P: 1-Main (J33.1), 2-EXS82 (TP_USB_DP.1 U1.45)
VUSB: 1-Main (J34.1), 2-EXS82 (C4.1 TP_VUSB.1 U1.44)